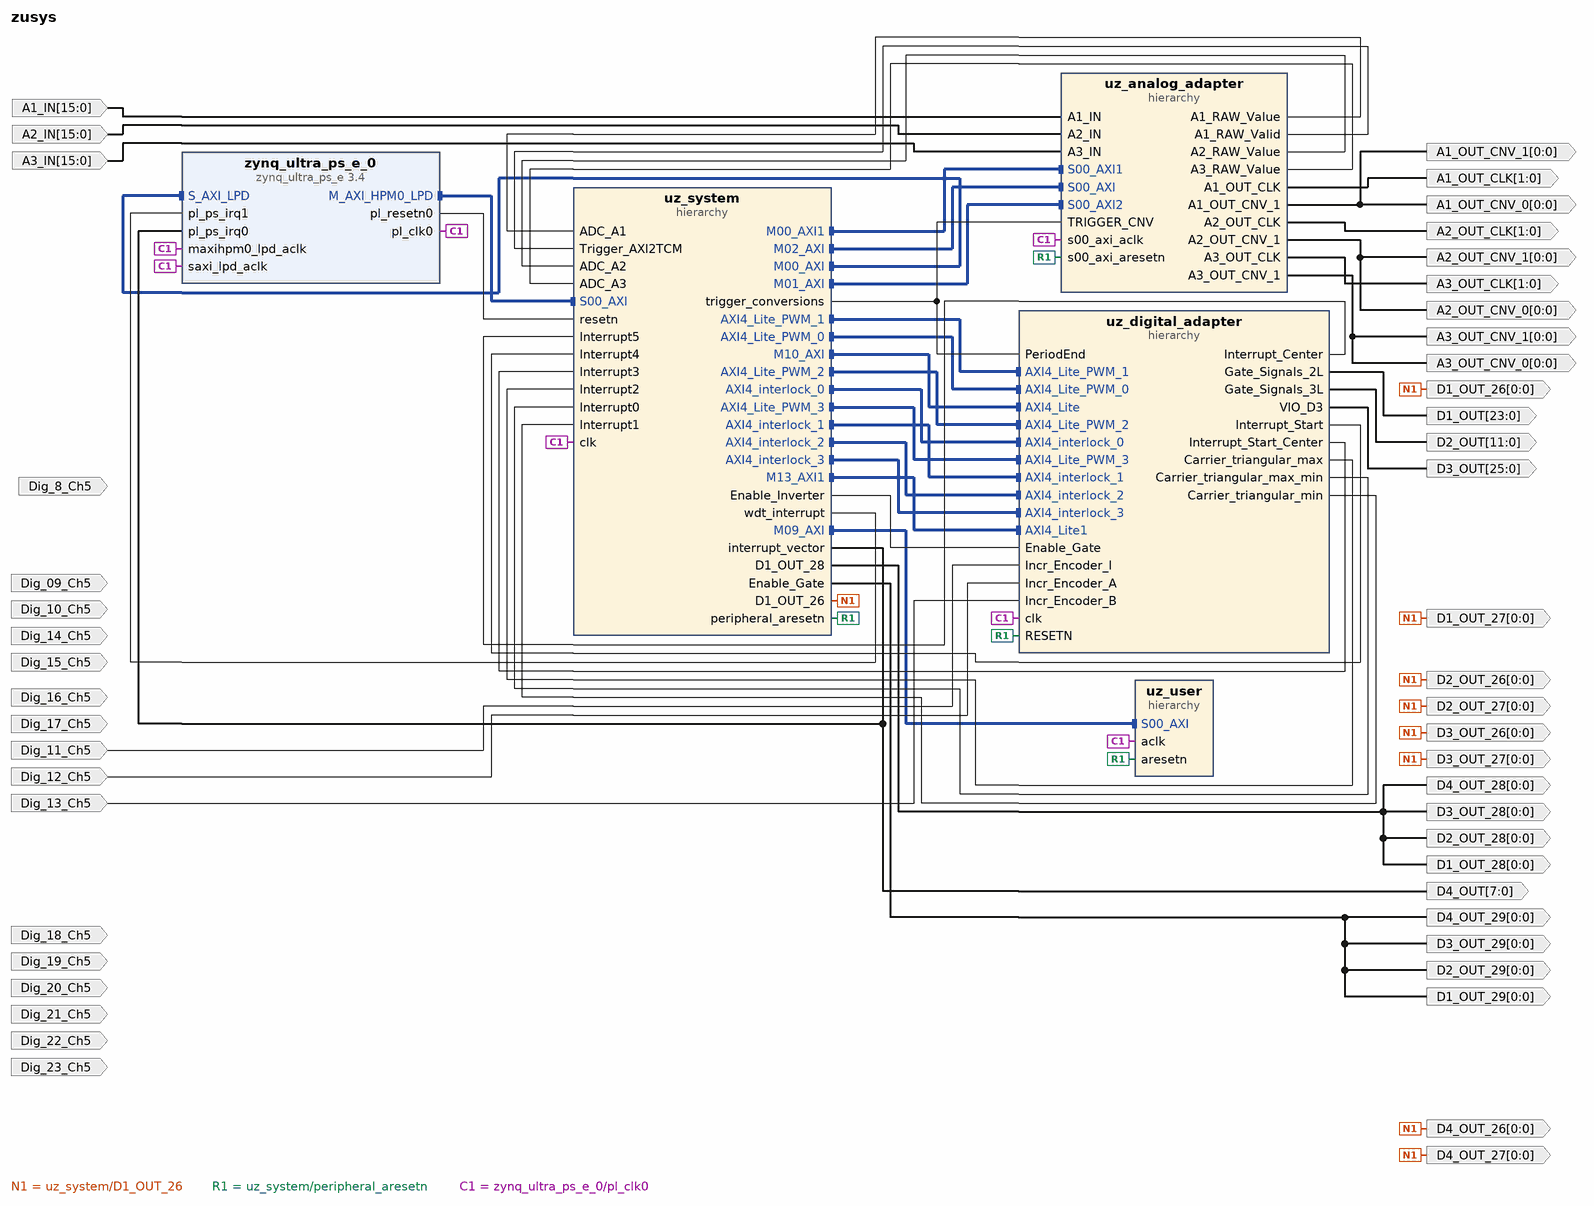
[diagram p0: block diagram of the top level]
# Vivado block design zusys, xczu9eg-ffvc900-1-e, Vivado 2022.2
create_bd_design zusys

create_bd_port -dir I -from 15 -to 0 A1_IN
create_bd_port -dir O -from 1 -to 0 A1_OUT_CLK
create_bd_port -dir O -from 0 -to 0 A1_OUT_CNV_0
create_bd_port -dir O -from 0 -to 0 A1_OUT_CNV_1
create_bd_port -dir I -from 15 -to 0 A2_IN
create_bd_port -dir O -from 1 -to 0 A2_OUT_CLK
create_bd_port -dir O -from 0 -to 0 A2_OUT_CNV_0
create_bd_port -dir O -from 0 -to 0 A2_OUT_CNV_1
create_bd_port -dir I -from 15 -to 0 A3_IN
create_bd_port -dir O -from 1 -to 0 A3_OUT_CLK
create_bd_port -dir O -from 0 -to 0 A3_OUT_CNV_0
create_bd_port -dir O -from 0 -to 0 A3_OUT_CNV_1
create_bd_port -dir O -from 23 -to 0 D1_OUT
create_bd_port -dir O -from 0 -to 0 D1_OUT_26
create_bd_port -dir O -from 0 -to 0 D1_OUT_27
create_bd_port -dir O -from 0 -to 0 D1_OUT_28
create_bd_port -dir O -from 0 -to 0 D1_OUT_29
create_bd_port -dir O -from 11 -to 0 D2_OUT
create_bd_port -dir O -from 0 -to 0 D2_OUT_26
create_bd_port -dir O -from 0 -to 0 D2_OUT_27
create_bd_port -dir O -from 0 -to 0 D2_OUT_28
create_bd_port -dir O -from 0 -to 0 D2_OUT_29
create_bd_port -dir O -from 25 -to 0 D3_OUT
create_bd_port -dir O -from 0 -to 0 D3_OUT_26
create_bd_port -dir O -from 0 -to 0 D3_OUT_27
create_bd_port -dir O -from 0 -to 0 D3_OUT_28
create_bd_port -dir O -from 0 -to 0 D3_OUT_29
create_bd_port -dir O -from 7 -to 0 D4_OUT
create_bd_port -dir O -from 0 -to 0 D4_OUT_26
create_bd_port -dir O -from 0 -to 0 D4_OUT_27
create_bd_port -dir O -from 0 -to 0 D4_OUT_28
create_bd_port -dir O -from 0 -to 0 D4_OUT_29
create_bd_port -dir I Dig_09_Ch5
create_bd_port -dir I Dig_10_Ch5
create_bd_port -dir I Dig_11_Ch5
create_bd_port -dir I Dig_12_Ch5
create_bd_port -dir I Dig_13_Ch5
create_bd_port -dir I Dig_14_Ch5
create_bd_port -dir I Dig_15_Ch5
create_bd_port -dir I Dig_16_Ch5
create_bd_port -dir I Dig_17_Ch5
create_bd_port -dir I Dig_18_Ch5
create_bd_port -dir I Dig_19_Ch5
create_bd_port -dir I Dig_20_Ch5
create_bd_port -dir I Dig_21_Ch5
create_bd_port -dir I Dig_22_Ch5
create_bd_port -dir I Dig_23_Ch5
create_bd_port -dir I Dig_8_Ch5

create_bd_cell -type hier uz_analog_adapter
create_bd_cell -type hier uz_digital_adapter
create_bd_cell -type hier uz_system
create_bd_cell -type hier uz_user
create_bd_cell -type ip -vlnv xilinx.com:ip:zynq_ultra_ps_e:3.4 zynq_ultra_ps_e_0
set_property -dict [list \
  CONFIG.CAN0_BOARD_INTERFACE custom \
  CONFIG.CAN1_BOARD_INTERFACE custom \
  CONFIG.CSU_BOARD_INTERFACE custom \
  CONFIG.DP_BOARD_INTERFACE custom \
  CONFIG.GEM0_BOARD_INTERFACE custom \
  CONFIG.GEM1_BOARD_INTERFACE custom \
  CONFIG.GEM2_BOARD_INTERFACE custom \
  CONFIG.GEM3_BOARD_INTERFACE custom \
  CONFIG.GPIO_BOARD_INTERFACE custom \
  CONFIG.IIC0_BOARD_INTERFACE custom \
  CONFIG.IIC1_BOARD_INTERFACE custom \
  CONFIG.NAND_BOARD_INTERFACE custom \
  CONFIG.PCIE_BOARD_INTERFACE custom \
  CONFIG.PJTAG_BOARD_INTERFACE custom \
  CONFIG.PMU_BOARD_INTERFACE custom \
  CONFIG.PSU_BANK_0_IO_STANDARD LVCMOS18 \
  CONFIG.PSU_BANK_1_IO_STANDARD LVCMOS18 \
  CONFIG.PSU_BANK_2_IO_STANDARD LVCMOS18 \
  CONFIG.PSU_BANK_3_IO_STANDARD LVCMOS18 \
  CONFIG.PSU_USB3__DUAL_CLOCK_ENABLE 0 \
  CONFIG.PSU__CAN0__PERIPHERAL__ENABLE 1 \
  CONFIG.PSU__CAN0__PERIPHERAL__IO {MIO 22 .. 23} \
  CONFIG.PSU__CAN1__PERIPHERAL__ENABLE 1 \
  CONFIG.PSU__CAN1__PERIPHERAL__IO {MIO 24 .. 25} \
  CONFIG.PSU__CRF_APB__ACPU_CTRL__FREQMHZ 1200 \
  CONFIG.PSU__CRF_APB__ACPU_CTRL__SRCSEL APLL \
  CONFIG.PSU__CRF_APB__APLL_CTRL__SRCSEL PSS_REF_CLK \
  CONFIG.PSU__CRF_APB__DBG_FPD_CTRL__FREQMHZ 250 \
  CONFIG.PSU__CRF_APB__DBG_FPD_CTRL__SRCSEL IOPLL \
  CONFIG.PSU__CRF_APB__DBG_TRACE_CTRL__FREQMHZ 250 \
  CONFIG.PSU__CRF_APB__DBG_TRACE_CTRL__SRCSEL IOPLL \
  CONFIG.PSU__CRF_APB__DBG_TSTMP_CTRL__FREQMHZ 250 \
  CONFIG.PSU__CRF_APB__DBG_TSTMP_CTRL__SRCSEL IOPLL \
  CONFIG.PSU__CRF_APB__DDR_CTRL__FREQMHZ 1200 \
  CONFIG.PSU__CRF_APB__DDR_CTRL__SRCSEL DPLL \
  CONFIG.PSU__CRF_APB__DPDMA_REF_CTRL__FREQMHZ 600 \
  CONFIG.PSU__CRF_APB__DPDMA_REF_CTRL__SRCSEL DPLL \
  CONFIG.PSU__CRF_APB__DPLL_CTRL__SRCSEL PSS_REF_CLK \
  CONFIG.PSU__CRF_APB__DP_AUDIO_REF_CTRL__SRCSEL VPLL \
  CONFIG.PSU__CRF_APB__DP_STC_REF_CTRL__SRCSEL VPLL \
  CONFIG.PSU__CRF_APB__DP_VIDEO_REF_CTRL__SRCSEL VPLL \
  CONFIG.PSU__CRF_APB__GDMA_REF_CTRL__FREQMHZ 600 \
  CONFIG.PSU__CRF_APB__GDMA_REF_CTRL__SRCSEL DPLL \
  CONFIG.PSU__CRF_APB__GPU_REF_CTRL__FREQMHZ 600 \
  CONFIG.PSU__CRF_APB__GPU_REF_CTRL__SRCSEL DPLL \
  CONFIG.PSU__CRF_APB__TOPSW_LSBUS_CTRL__FREQMHZ 100 \
  CONFIG.PSU__CRF_APB__TOPSW_LSBUS_CTRL__SRCSEL IOPLL \
  CONFIG.PSU__CRF_APB__TOPSW_MAIN_CTRL__FREQMHZ 533.333 \
  CONFIG.PSU__CRF_APB__TOPSW_MAIN_CTRL__SRCSEL APLL \
  CONFIG.PSU__CRF_APB__VPLL_CTRL__SRCSEL PSS_REF_CLK \
  CONFIG.PSU__CRL_APB__ADMA_REF_CTRL__FREQMHZ 500 \
  CONFIG.PSU__CRL_APB__ADMA_REF_CTRL__SRCSEL IOPLL \
  CONFIG.PSU__CRL_APB__CAN1_REF_CTRL__FREQMHZ 100 \
  CONFIG.PSU__CRL_APB__CAN1_REF_CTRL__SRCSEL IOPLL \
  CONFIG.PSU__CRL_APB__CPU_R5_CTRL__FREQMHZ 500 \
  CONFIG.PSU__CRL_APB__CPU_R5_CTRL__SRCSEL IOPLL \
  CONFIG.PSU__CRL_APB__DBG_LPD_CTRL__FREQMHZ 250 \
  CONFIG.PSU__CRL_APB__DBG_LPD_CTRL__SRCSEL IOPLL \
  CONFIG.PSU__CRL_APB__GEM3_REF_CTRL__FREQMHZ 125 \
  CONFIG.PSU__CRL_APB__GEM3_REF_CTRL__SRCSEL IOPLL \
  CONFIG.PSU__CRL_APB__I2C0_REF_CTRL__FREQMHZ 100 \
  CONFIG.PSU__CRL_APB__I2C0_REF_CTRL__SRCSEL IOPLL \
  CONFIG.PSU__CRL_APB__I2C1_REF_CTRL__FREQMHZ 100 \
  CONFIG.PSU__CRL_APB__I2C1_REF_CTRL__SRCSEL IOPLL \
  CONFIG.PSU__CRL_APB__IOPLL_CTRL__SRCSEL PSS_REF_CLK \
  CONFIG.PSU__CRL_APB__IOU_SWITCH_CTRL__FREQMHZ 267 \
  CONFIG.PSU__CRL_APB__IOU_SWITCH_CTRL__SRCSEL RPLL \
  CONFIG.PSU__CRL_APB__LPD_LSBUS_CTRL__FREQMHZ 100 \
  CONFIG.PSU__CRL_APB__LPD_LSBUS_CTRL__SRCSEL IOPLL \
  CONFIG.PSU__CRL_APB__LPD_SWITCH_CTRL__FREQMHZ 500 \
  CONFIG.PSU__CRL_APB__LPD_SWITCH_CTRL__SRCSEL IOPLL \
  CONFIG.PSU__CRL_APB__PCAP_CTRL__FREQMHZ 200 \
  CONFIG.PSU__CRL_APB__PCAP_CTRL__SRCSEL IOPLL \
  CONFIG.PSU__CRL_APB__PL0_REF_CTRL__FREQMHZ 100 \
  CONFIG.PSU__CRL_APB__PL0_REF_CTRL__SRCSEL RPLL \
  CONFIG.PSU__CRL_APB__QSPI_REF_CTRL__FREQMHZ 300 \
  CONFIG.PSU__CRL_APB__QSPI_REF_CTRL__SRCSEL IOPLL \
  CONFIG.PSU__CRL_APB__RPLL_CTRL__SRCSEL PSS_REF_CLK \
  CONFIG.PSU__CRL_APB__SDIO1_REF_CTRL__FREQMHZ 200 \
  CONFIG.PSU__CRL_APB__SDIO1_REF_CTRL__SRCSEL RPLL \
  CONFIG.PSU__CRL_APB__TIMESTAMP_REF_CTRL__FREQMHZ 100 \
  CONFIG.PSU__CRL_APB__TIMESTAMP_REF_CTRL__SRCSEL PSS_REF_CLK \
  CONFIG.PSU__CRL_APB__UART0_REF_CTRL__FREQMHZ 100 \
  CONFIG.PSU__CRL_APB__UART0_REF_CTRL__SRCSEL IOPLL \
  CONFIG.PSU__CRL_APB__UART1_REF_CTRL__FREQMHZ 100 \
  CONFIG.PSU__CRL_APB__UART1_REF_CTRL__SRCSEL IOPLL \
  CONFIG.PSU__CRL_APB__USB0_BUS_REF_CTRL__FREQMHZ 250 \
  CONFIG.PSU__CRL_APB__USB0_BUS_REF_CTRL__SRCSEL IOPLL \
  CONFIG.PSU__CRL_APB__USB3_DUAL_REF_CTRL__FREQMHZ 20 \
  CONFIG.PSU__CRL_APB__USB3_DUAL_REF_CTRL__SRCSEL IOPLL \
  CONFIG.PSU__CRL_APB__USB3__ENABLE 0 \
  CONFIG.PSU__CSUPMU__PERIPHERAL__VALID 0 \
  CONFIG.PSU__DDRC__BUS_WIDTH {64 Bit} \
  CONFIG.PSU__DDRC__COMPONENTS Components \
  CONFIG.PSU__DDRC__DEVICE_CAPACITY {8192 MBits} \
  CONFIG.PSU__DDRC__DRAM_WIDTH {16 Bits} \
  CONFIG.PSU__DDRC__ECC Disabled \
  CONFIG.PSU__DDRC__MEMORY_TYPE {DDR 4} \
  CONFIG.PSU__DDRC__SPEED_BIN DDR4_2400P \
  CONFIG.PSU__DDR_HIGH_ADDRESS_GUI_ENABLE 1 \
  CONFIG.PSU__DDR__INTERFACE__FREQMHZ 600.000 \
  CONFIG.PSU__DEVICE_TYPE EG \
  CONFIG.PSU__DISPLAYPORT__PERIPHERAL__ENABLE 0 \
  CONFIG.PSU__DLL__ISUSED 1 \
  CONFIG.PSU__ENET3__FIFO__ENABLE 0 \
  CONFIG.PSU__ENET3__GRP_MDIO__ENABLE 1 \
  CONFIG.PSU__ENET3__GRP_MDIO__IO {MIO 76 .. 77} \
  CONFIG.PSU__ENET3__PERIPHERAL__ENABLE 1 \
  CONFIG.PSU__ENET3__PERIPHERAL__IO {MIO 64 .. 75} \
  CONFIG.PSU__ENET3__PTP__ENABLE 0 \
  CONFIG.PSU__ENET3__TSU__ENABLE 0 \
  CONFIG.PSU__FPD_SLCR__WDT1__FREQMHZ 99.999985 \
  CONFIG.PSU__FPGA_PL0_ENABLE 1 \
  CONFIG.PSU__GEM3_COHERENCY 0 \
  CONFIG.PSU__GEM3_ROUTE_THROUGH_FPD 0 \
  CONFIG.PSU__GEM__TSU__ENABLE 0 \
  CONFIG.PSU__GPIO0_MIO__IO {MIO 0 .. 25} \
  CONFIG.PSU__GPIO0_MIO__PERIPHERAL__ENABLE 1 \
  CONFIG.PSU__GPIO1_MIO__IO {MIO 26 .. 51} \
  CONFIG.PSU__GPIO1_MIO__PERIPHERAL__ENABLE 1 \
  CONFIG.PSU__GPIO2_MIO__IO {MIO 52 .. 77} \
  CONFIG.PSU__GPIO2_MIO__PERIPHERAL__ENABLE 1 \
  CONFIG.PSU__I2C0__PERIPHERAL__ENABLE 1 \
  CONFIG.PSU__I2C0__PERIPHERAL__IO {MIO 14 .. 15} \
  CONFIG.PSU__I2C1__PERIPHERAL__ENABLE 1 \
  CONFIG.PSU__I2C1__PERIPHERAL__IO {MIO 16 .. 17} \
  CONFIG.PSU__IOU_SLCR__IOU_TTC_APB_CLK__TTC0_SEL APB \
  CONFIG.PSU__IOU_SLCR__IOU_TTC_APB_CLK__TTC1_SEL APB \
  CONFIG.PSU__IOU_SLCR__IOU_TTC_APB_CLK__TTC2_SEL APB \
  CONFIG.PSU__IOU_SLCR__IOU_TTC_APB_CLK__TTC3_SEL APB \
  CONFIG.PSU__IOU_SLCR__WDT0__FREQMHZ 99.999985 \
  CONFIG.PSU__LPD_SLCR__CSUPMU__FREQMHZ 100 \
  CONFIG.PSU__MAXIGP2__DATA_WIDTH 128 \
  CONFIG.PSU__M_AXI_GP2__FREQMHZ 100.0 \
  CONFIG.PSU__OVERRIDE_HPX_QOS 0 \
  CONFIG.PSU__OVERRIDE__BASIC_CLOCK 0 \
  CONFIG.PSU__PCIE__CLASS_CODE_BASE 0x06 \
  CONFIG.PSU__PCIE__CLASS_CODE_INTERFACE 0x0 \
  CONFIG.PSU__PCIE__CLASS_CODE_SUB 0x04 \
  CONFIG.PSU__PCIE__DEVICE_ID 0xD021 \
  CONFIG.PSU__PCIE__REVISION_ID 0x0 \
  CONFIG.PSU__PCIE__SUBSYSTEM_ID 0x7 \
  CONFIG.PSU__PCIE__SUBSYSTEM_VENDOR_ID 0x10EE \
  CONFIG.PSU__PCIE__VENDOR_ID 0x10EE \
  CONFIG.PSU__PMU__PERIPHERAL__ENABLE 0 \
  CONFIG.PSU__PRESET_APPLIED 0 \
  CONFIG.PSU__PSS_REF_CLK__FREQMHZ 33.333333 \
  CONFIG.PSU__QSPI_COHERENCY 0 \
  CONFIG.PSU__QSPI_ROUTE_THROUGH_FPD 0 \
  CONFIG.PSU__QSPI__GRP_FBCLK__ENABLE 1 \
  CONFIG.PSU__QSPI__GRP_FBCLK__IO {MIO 6} \
  CONFIG.PSU__QSPI__PERIPHERAL__DATA_MODE x4 \
  CONFIG.PSU__QSPI__PERIPHERAL__ENABLE 1 \
  CONFIG.PSU__QSPI__PERIPHERAL__IO {MIO 0 .. 12} \
  CONFIG.PSU__QSPI__PERIPHERAL__MODE {Dual Parallel} \
  CONFIG.PSU__SATA__PERIPHERAL__ENABLE 0 \
  CONFIG.PSU__SAXIGP6__DATA_WIDTH 32 \
  CONFIG.PSU__SD0__CLK_100_SDR_OTAP_DLY 0x3 \
  CONFIG.PSU__SD0__CLK_200_SDR_OTAP_DLY 0x3 \
  CONFIG.PSU__SD0__CLK_50_DDR_ITAP_DLY 0x3D \
  CONFIG.PSU__SD0__CLK_50_DDR_OTAP_DLY 0x4 \
  CONFIG.PSU__SD0__CLK_50_SDR_ITAP_DLY 0x15 \
  CONFIG.PSU__SD0__CLK_50_SDR_OTAP_DLY 0x5 \
  CONFIG.PSU__SD0__RESET__ENABLE 1 \
  CONFIG.PSU__SD1_COHERENCY 0 \
  CONFIG.PSU__SD1_ROUTE_THROUGH_FPD 0 \
  CONFIG.PSU__SD1__CLK_50_SDR_ITAP_DLY 0x15 \
  CONFIG.PSU__SD1__CLK_50_SDR_OTAP_DLY 0x5 \
  CONFIG.PSU__SD1__DATA_TRANSFER_MODE 4Bit \
  CONFIG.PSU__SD1__GRP_CD__ENABLE 0 \
  CONFIG.PSU__SD1__GRP_POW__ENABLE 0 \
  CONFIG.PSU__SD1__GRP_WP__ENABLE 0 \
  CONFIG.PSU__SD1__PERIPHERAL__ENABLE 1 \
  CONFIG.PSU__SD1__PERIPHERAL__IO {MIO 46 .. 51} \
  CONFIG.PSU__SD1__SLOT_TYPE {SD 2.0} \
  CONFIG.PSU__SPI0__GRP_SS0__IO {MIO 41} \
  CONFIG.PSU__SPI0__PERIPHERAL__ENABLE 1 \
  CONFIG.PSU__SPI0__PERIPHERAL__IO {MIO 38 .. 43} \
  CONFIG.PSU__SPI1__GRP_SS0__IO {MIO 35} \
  CONFIG.PSU__SPI1__PERIPHERAL__ENABLE 1 \
  CONFIG.PSU__SPI1__PERIPHERAL__IO {MIO 32 .. 37} \
  CONFIG.PSU__SWDT0__PERIPHERAL__ENABLE 0 \
  CONFIG.PSU__SWDT1__PERIPHERAL__ENABLE 0 \
  CONFIG.PSU__TSU__BUFG_PORT_PAIR 0 \
  CONFIG.PSU__TTC0__CLOCK__ENABLE 0 \
  CONFIG.PSU__TTC0__PERIPHERAL__ENABLE 1 \
  CONFIG.PSU__TTC0__WAVEOUT__ENABLE 0 \
  CONFIG.PSU__TTC1__PERIPHERAL__ENABLE 0 \
  CONFIG.PSU__TTC2__PERIPHERAL__ENABLE 0 \
  CONFIG.PSU__TTC3__CLOCK__ENABLE 0 \
  CONFIG.PSU__TTC3__PERIPHERAL__ENABLE 1 \
  CONFIG.PSU__TTC3__WAVEOUT__ENABLE 0 \
  CONFIG.PSU__UART0__BAUD_RATE 115200 \
  CONFIG.PSU__UART0__MODEM__ENABLE 0 \
  CONFIG.PSU__UART0__PERIPHERAL__ENABLE 1 \
  CONFIG.PSU__UART0__PERIPHERAL__IO {MIO 18 .. 19} \
  CONFIG.PSU__UART1__BAUD_RATE 115200 \
  CONFIG.PSU__UART1__MODEM__ENABLE 0 \
  CONFIG.PSU__UART1__PERIPHERAL__ENABLE 1 \
  CONFIG.PSU__UART1__PERIPHERAL__IO {MIO 20 .. 21} \
  CONFIG.PSU__USB0__PERIPHERAL__ENABLE 0 \
  CONFIG.PSU__USE__IRQ0 1 \
  CONFIG.PSU__USE__IRQ1 1 \
  CONFIG.PSU__USE__M_AXI_GP0 0 \
  CONFIG.PSU__USE__M_AXI_GP1 0 \
  CONFIG.PSU__USE__M_AXI_GP2 1 \
  CONFIG.PSU__USE__S_AXI_GP6 1 \
  CONFIG.QSPI_BOARD_INTERFACE custom \
  CONFIG.SATA_BOARD_INTERFACE custom \
  CONFIG.SD0_BOARD_INTERFACE custom \
  CONFIG.SD1_BOARD_INTERFACE custom \
  CONFIG.SPI0_BOARD_INTERFACE custom \
  CONFIG.SPI1_BOARD_INTERFACE custom \
  CONFIG.SUBPRESET1 Custom \
  CONFIG.SUBPRESET2 Custom \
  CONFIG.SWDT0_BOARD_INTERFACE custom \
  CONFIG.SWDT1_BOARD_INTERFACE custom \
  CONFIG.TRACE_BOARD_INTERFACE custom \
  CONFIG.TTC0_BOARD_INTERFACE custom \
  CONFIG.TTC1_BOARD_INTERFACE custom \
  CONFIG.TTC2_BOARD_INTERFACE custom \
  CONFIG.TTC3_BOARD_INTERFACE custom \
  CONFIG.UART0_BOARD_INTERFACE custom \
  CONFIG.UART1_BOARD_INTERFACE custom \
  CONFIG.USB0_BOARD_INTERFACE custom \
  CONFIG.USB1_BOARD_INTERFACE custom \
] [get_bd_cells zynq_ultra_ps_e_0]
# 753 more settings of zynq_ultra_ps_e_0 are not shown: defaults, MIO pin electricals, DDR timing, and values the tool derives

# ---- hierarchy /uz_analog_adapter ----
current_bd_instance /uz_analog_adapter
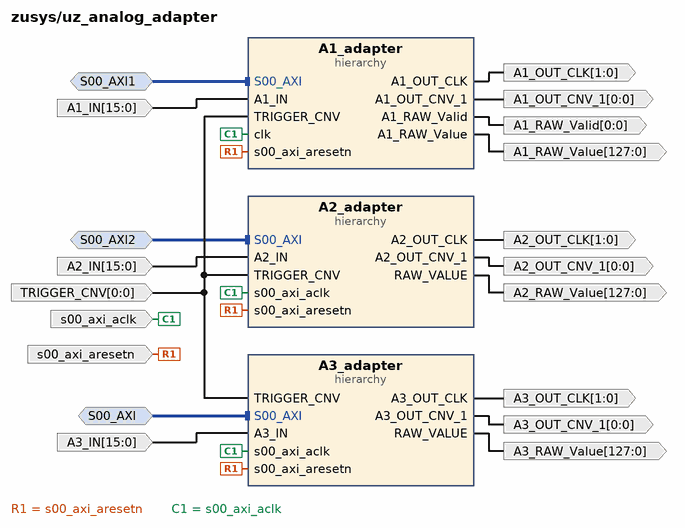
[diagram p1: block diagram inside /uz_analog_adapter]
create_bd_intf_pin -mode Slave -vlnv xilinx.com:interface:aximm_rtl:1.0 S00_AXI
create_bd_intf_pin -mode Slave -vlnv xilinx.com:interface:aximm_rtl:1.0 S00_AXI1
create_bd_intf_pin -mode Slave -vlnv xilinx.com:interface:aximm_rtl:1.0 S00_AXI2
create_bd_pin -dir I -from 15 -to 0 A1_IN
create_bd_pin -dir O -from 1 -to 0 A1_OUT_CLK
create_bd_pin -dir O -from 0 -to 0 A1_OUT_CNV_1
create_bd_pin -dir O -from 0 -to 0 A1_RAW_Valid
create_bd_pin -dir O -from 127 -to 0 A1_RAW_Value
create_bd_pin -dir I -from 15 -to 0 A2_IN
create_bd_pin -dir O -from 1 -to 0 A2_OUT_CLK
create_bd_pin -dir O -from 0 -to 0 A2_OUT_CNV_1
create_bd_pin -dir O -from 127 -to 0 A2_RAW_Value
create_bd_pin -dir I -from 15 -to 0 A3_IN
create_bd_pin -dir O -from 1 -to 0 A3_OUT_CLK
create_bd_pin -dir O -from 0 -to 0 A3_OUT_CNV_1
create_bd_pin -dir O -from 127 -to 0 A3_RAW_Value
create_bd_pin -dir I -from 0 -to 0 TRIGGER_CNV
create_bd_pin -dir I -type clk s00_axi_aclk
create_bd_pin -dir I -type rst s00_axi_aresetn

create_bd_cell -type hier A1_adapter
create_bd_cell -type hier A2_adapter
create_bd_cell -type hier A3_adapter

# ---- hierarchy /uz_analog_adapter/A1_adapter ----
current_bd_instance /uz_analog_adapter/A1_adapter
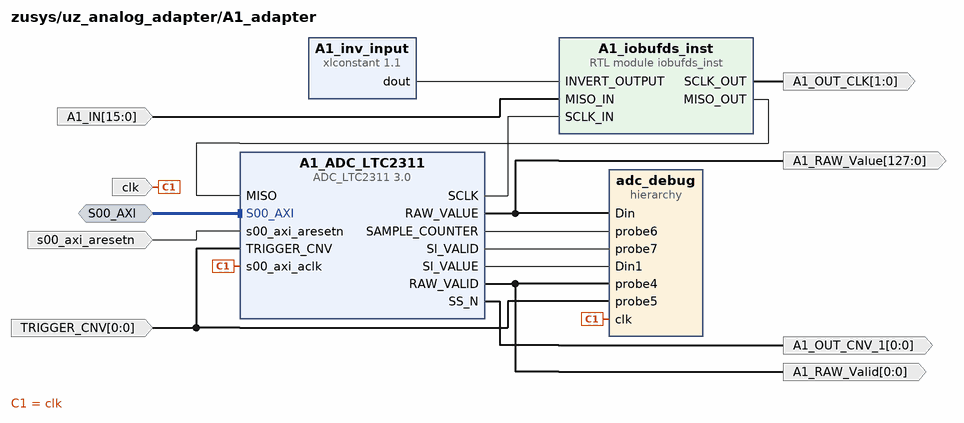
[diagram p2: block diagram inside /uz_analog_adapter/A1_adapter]
create_bd_intf_pin -mode Slave -vlnv xilinx.com:interface:aximm_rtl:1.0 S00_AXI
create_bd_pin -dir I -from 15 -to 0 A1_IN
create_bd_pin -dir O -from 1 -to 0 A1_OUT_CLK
create_bd_pin -dir O -from 0 -to 0 A1_OUT_CNV_1
create_bd_pin -dir O -from 0 -to 0 A1_RAW_Valid
create_bd_pin -dir O -from 127 -to 0 A1_RAW_Value
create_bd_pin -dir I -type clk clk
create_bd_pin -dir I -from 0 -to 0 TRIGGER_CNV
create_bd_pin -dir I -type rst s00_axi_aresetn

create_bd_cell -type ip -vlnv UltraZohm:user:ADC_LTC2311:3.0 A1_ADC_LTC2311
set_property -dict [list \
  CONFIG.DIFFERENTIAL false \
  CONFIG.RES_LSB 0 \
  CONFIG.RES_MSB 34 \
  CONFIG.SPI_MASTER 1 \
] [get_bd_cells A1_ADC_LTC2311]
create_bd_cell -type ip -vlnv xilinx.com:ip:xlconstant:1.1 A1_inv_input
set_property -dict {CONFIG.CONST_VAL 0x00 CONFIG.CONST_WIDTH 8} [get_bd_cells A1_inv_input]
create_bd_cell -type module -reference iobufds_inst A1_iobufds_inst
create_bd_cell -type hier adc_debug

# ---- hierarchy /uz_analog_adapter/A1_adapter/adc_debug ----
current_bd_instance /uz_analog_adapter/A1_adapter/adc_debug
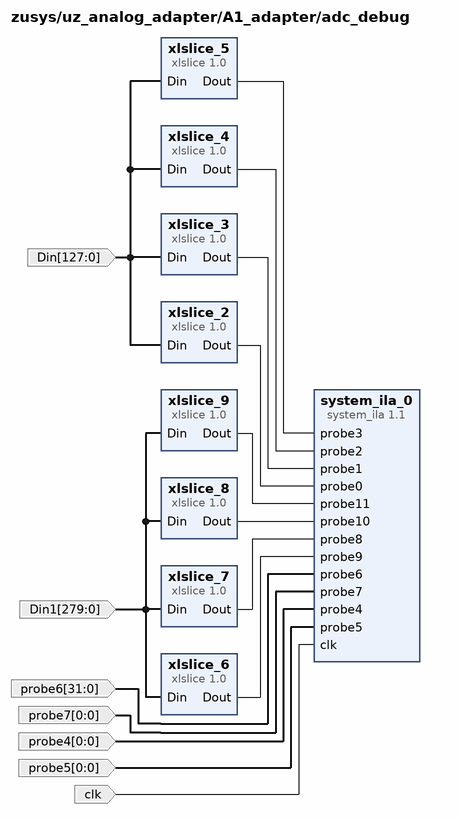
[diagram p3: block diagram inside /uz_analog_adapter/A1_adapter/adc_debug]
create_bd_pin -dir I -from 127 -to 0 Din
create_bd_pin -dir I -from 279 -to 0 Din1
create_bd_pin -dir I -type clk clk
create_bd_pin -dir I -from 0 -to 0 probe4
create_bd_pin -dir I -from 0 -to 0 probe5
create_bd_pin -dir I -from 31 -to 0 probe6
create_bd_pin -dir I -from 0 -to 0 probe7

create_bd_cell -type ip -vlnv xilinx.com:ip:system_ila:1.1 system_ila_0
set_property -dict {CONFIG.C_DATA_DEPTH 1024 CONFIG.C_MON_TYPE NATIVE CONFIG.C_NUM_OF_PROBES 12} [get_bd_cells system_ila_0]
create_bd_cell -type ip -vlnv xilinx.com:ip:xlslice:1.0 xlslice_2
set_property -dict {CONFIG.DIN_FROM 15 CONFIG.DIN_WIDTH 128 CONFIG.DOUT_WIDTH 16} [get_bd_cells xlslice_2]
create_bd_cell -type ip -vlnv xilinx.com:ip:xlslice:1.0 xlslice_3
set_property -dict {CONFIG.DIN_FROM 31 CONFIG.DIN_TO 16 CONFIG.DIN_WIDTH 128 CONFIG.DOUT_WIDTH 16} [get_bd_cells xlslice_3]
create_bd_cell -type ip -vlnv xilinx.com:ip:xlslice:1.0 xlslice_4
set_property -dict {CONFIG.DIN_FROM 47 CONFIG.DIN_TO 32 CONFIG.DIN_WIDTH 128 CONFIG.DOUT_WIDTH 16} [get_bd_cells xlslice_4]
create_bd_cell -type ip -vlnv xilinx.com:ip:xlslice:1.0 xlslice_5
set_property -dict {CONFIG.DIN_FROM 63 CONFIG.DIN_TO 48 CONFIG.DIN_WIDTH 128 CONFIG.DOUT_WIDTH 16} [get_bd_cells xlslice_5]
create_bd_cell -type ip -vlnv xilinx.com:ip:xlslice:1.0 xlslice_6
set_property -dict {CONFIG.DIN_FROM 69 CONFIG.DIN_TO 35 CONFIG.DIN_WIDTH 280 CONFIG.DOUT_WIDTH 35} [get_bd_cells xlslice_6]
create_bd_cell -type ip -vlnv xilinx.com:ip:xlslice:1.0 xlslice_7
set_property -dict {CONFIG.DIN_FROM 34 CONFIG.DIN_WIDTH 280 CONFIG.DOUT_WIDTH 35} [get_bd_cells xlslice_7]
create_bd_cell -type ip -vlnv xilinx.com:ip:xlslice:1.0 xlslice_8
set_property -dict {CONFIG.DIN_FROM 69 CONFIG.DIN_TO 35 CONFIG.DIN_WIDTH 280 CONFIG.DOUT_WIDTH 35} [get_bd_cells xlslice_8]
create_bd_cell -type ip -vlnv xilinx.com:ip:xlslice:1.0 xlslice_9
set_property -dict {CONFIG.DIN_FROM 104 CONFIG.DIN_TO 70 CONFIG.DIN_WIDTH 280 CONFIG.DOUT_WIDTH 35} [get_bd_cells xlslice_9]

# ---- hierarchy /uz_analog_adapter/A2_adapter ----
current_bd_instance /uz_analog_adapter/A2_adapter
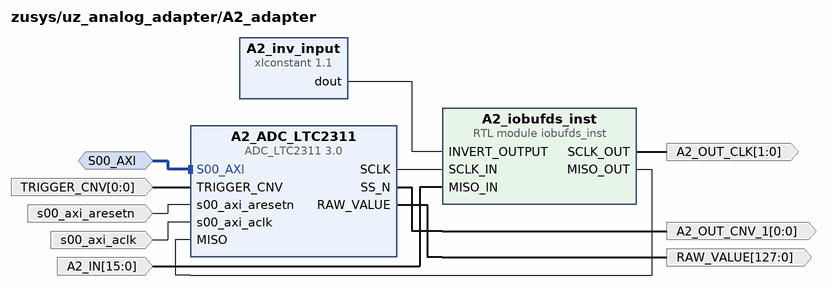
[diagram p4: block diagram inside /uz_analog_adapter/A2_adapter]
create_bd_intf_pin -mode Slave -vlnv xilinx.com:interface:aximm_rtl:1.0 S00_AXI
create_bd_pin -dir I -from 15 -to 0 A2_IN
create_bd_pin -dir O -from 1 -to 0 A2_OUT_CLK
create_bd_pin -dir O -from 0 -to 0 A2_OUT_CNV_1
create_bd_pin -dir O -from 127 -to 0 RAW_VALUE
create_bd_pin -dir I -from 0 -to 0 TRIGGER_CNV
create_bd_pin -dir I -type clk s00_axi_aclk
create_bd_pin -dir I -type rst s00_axi_aresetn

create_bd_cell -type ip -vlnv UltraZohm:user:ADC_LTC2311:3.0 A2_ADC_LTC2311
set_property -dict {CONFIG.DIFFERENTIAL false CONFIG.RES_LSB 0 CONFIG.RES_MSB 34} [get_bd_cells A2_ADC_LTC2311]
create_bd_cell -type ip -vlnv xilinx.com:ip:xlconstant:1.1 A2_inv_input
set_property -dict {CONFIG.CONST_VAL 0x00 CONFIG.CONST_WIDTH 8} [get_bd_cells A2_inv_input]
create_bd_cell -type module -reference iobufds_inst A2_iobufds_inst

# ---- hierarchy /uz_analog_adapter/A3_adapter ----
current_bd_instance /uz_analog_adapter/A3_adapter
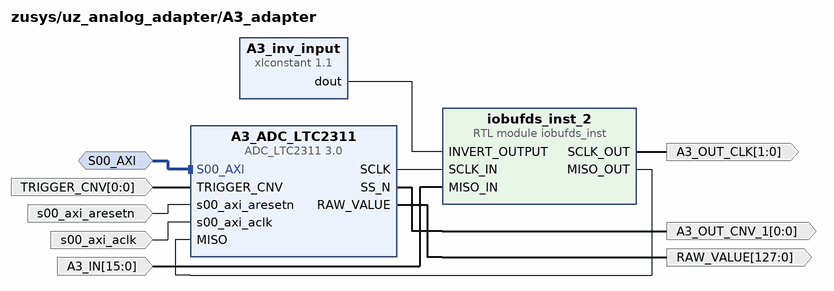
[diagram p5: block diagram inside /uz_analog_adapter/A3_adapter]
create_bd_intf_pin -mode Slave -vlnv xilinx.com:interface:aximm_rtl:1.0 S00_AXI
create_bd_pin -dir I -from 15 -to 0 A3_IN
create_bd_pin -dir O -from 1 -to 0 A3_OUT_CLK
create_bd_pin -dir O -from 0 -to 0 A3_OUT_CNV_1
create_bd_pin -dir O -from 127 -to 0 RAW_VALUE
create_bd_pin -dir I -from 0 -to 0 TRIGGER_CNV
create_bd_pin -dir I -type clk s00_axi_aclk
create_bd_pin -dir I -type rst s00_axi_aresetn

create_bd_cell -type ip -vlnv UltraZohm:user:ADC_LTC2311:3.0 A3_ADC_LTC2311
set_property -dict {CONFIG.DIFFERENTIAL false CONFIG.RES_LSB 0 CONFIG.RES_MSB 34} [get_bd_cells A3_ADC_LTC2311]
create_bd_cell -type ip -vlnv xilinx.com:ip:xlconstant:1.1 A3_inv_input
set_property -dict {CONFIG.CONST_VAL 0x00 CONFIG.CONST_WIDTH 8} [get_bd_cells A3_inv_input]
create_bd_cell -type module -reference iobufds_inst iobufds_inst_2

# ---- hierarchy /uz_digital_adapter ----
current_bd_instance /uz_digital_adapter
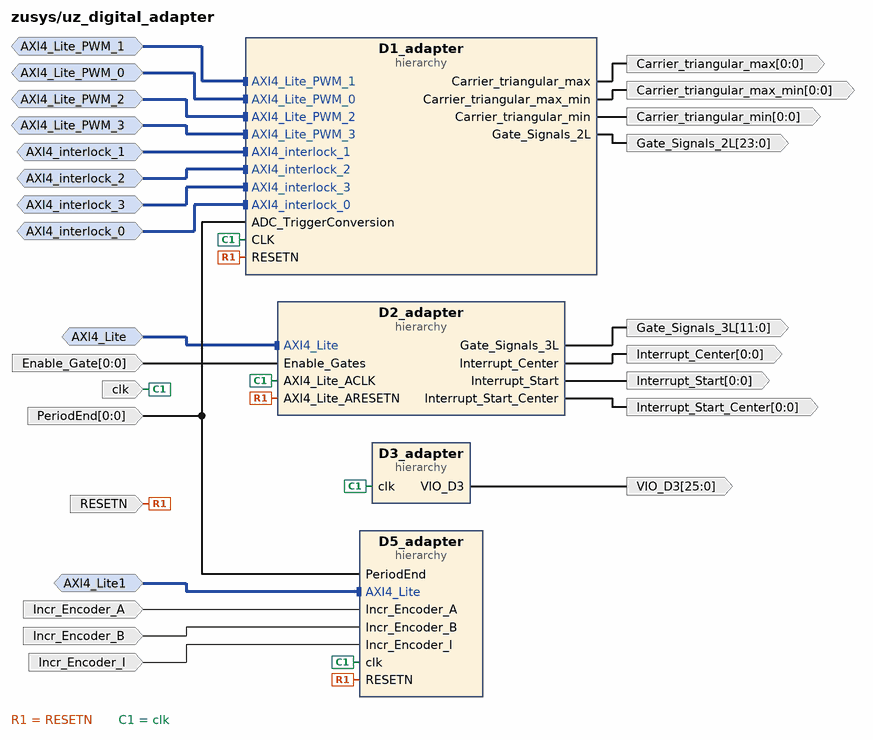
[diagram p6: block diagram inside /uz_digital_adapter]
create_bd_intf_pin -mode Slave -vlnv xilinx.com:interface:aximm_rtl:1.0 AXI4_Lite
create_bd_intf_pin -mode Slave -vlnv xilinx.com:interface:aximm_rtl:1.0 AXI4_Lite1
create_bd_intf_pin -mode Slave -vlnv xilinx.com:interface:aximm_rtl:1.0 AXI4_Lite_PWM_0
create_bd_intf_pin -mode Slave -vlnv xilinx.com:interface:aximm_rtl:1.0 AXI4_Lite_PWM_1
create_bd_intf_pin -mode Slave -vlnv xilinx.com:interface:aximm_rtl:1.0 AXI4_Lite_PWM_2
create_bd_intf_pin -mode Slave -vlnv xilinx.com:interface:aximm_rtl:1.0 AXI4_Lite_PWM_3
create_bd_intf_pin -mode Slave -vlnv xilinx.com:interface:aximm_rtl:1.0 AXI4_interlock_0
create_bd_intf_pin -mode Slave -vlnv xilinx.com:interface:aximm_rtl:1.0 AXI4_interlock_1
create_bd_intf_pin -mode Slave -vlnv xilinx.com:interface:aximm_rtl:1.0 AXI4_interlock_2
create_bd_intf_pin -mode Slave -vlnv xilinx.com:interface:aximm_rtl:1.0 AXI4_interlock_3
create_bd_pin -dir O -from 0 -to 0 Carrier_triangular_max
create_bd_pin -dir O -from 0 -to 0 Carrier_triangular_max_min
create_bd_pin -dir O -from 0 -to 0 Carrier_triangular_min
create_bd_pin -dir I -from 0 -to 0 Enable_Gate
create_bd_pin -dir O -from 23 -to 0 Gate_Signals_2L
create_bd_pin -dir O -from 11 -to 0 Gate_Signals_3L
create_bd_pin -dir I Incr_Encoder_A
create_bd_pin -dir I Incr_Encoder_B
create_bd_pin -dir I Incr_Encoder_I
create_bd_pin -dir O -from 0 -to 0 Interrupt_Center
create_bd_pin -dir O -from 0 -to 0 Interrupt_Start
create_bd_pin -dir O -from 0 -to 0 Interrupt_Start_Center
create_bd_pin -dir I -from 0 -to 0 PeriodEnd
create_bd_pin -dir I -type rst RESETN
create_bd_pin -dir O -from 25 -to 0 VIO_D3
create_bd_pin -dir I -type clk clk

create_bd_cell -type hier D1_adapter
create_bd_cell -type hier D2_adapter
create_bd_cell -type hier D3_adapter
create_bd_cell -type hier D5_adapter

# ---- hierarchy /uz_digital_adapter/D1_adapter ----
current_bd_instance /uz_digital_adapter/D1_adapter
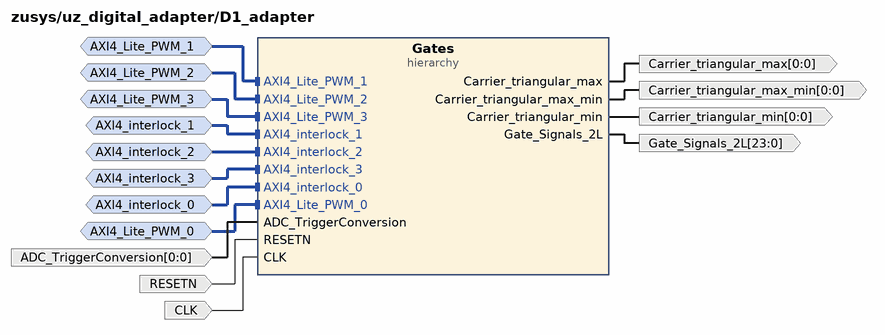
[diagram p7: block diagram inside /uz_digital_adapter/D1_adapter]
create_bd_intf_pin -mode Slave -vlnv xilinx.com:interface:aximm_rtl:1.0 AXI4_Lite_PWM_0
create_bd_intf_pin -mode Slave -vlnv xilinx.com:interface:aximm_rtl:1.0 AXI4_Lite_PWM_1
create_bd_intf_pin -mode Slave -vlnv xilinx.com:interface:aximm_rtl:1.0 AXI4_Lite_PWM_2
create_bd_intf_pin -mode Slave -vlnv xilinx.com:interface:aximm_rtl:1.0 AXI4_Lite_PWM_3
create_bd_intf_pin -mode Slave -vlnv xilinx.com:interface:aximm_rtl:1.0 AXI4_interlock_0
create_bd_intf_pin -mode Slave -vlnv xilinx.com:interface:aximm_rtl:1.0 AXI4_interlock_1
create_bd_intf_pin -mode Slave -vlnv xilinx.com:interface:aximm_rtl:1.0 AXI4_interlock_2
create_bd_intf_pin -mode Slave -vlnv xilinx.com:interface:aximm_rtl:1.0 AXI4_interlock_3
create_bd_pin -dir I -type clk CLK
create_bd_pin -dir O -from 0 -to 0 Carrier_triangular_max
create_bd_pin -dir O -from 0 -to 0 Carrier_triangular_max_min
create_bd_pin -dir O -from 0 -to 0 Carrier_triangular_min
create_bd_pin -dir O -from 23 -to 0 Gate_Signals_2L
create_bd_pin -dir I -type rst RESETN
create_bd_pin -dir I -from 0 -to 0 ADC_TriggerConversion

create_bd_cell -type hier Gates

# ---- hierarchy /uz_digital_adapter/D1_adapter/Gates ----
current_bd_instance /uz_digital_adapter/D1_adapter/Gates
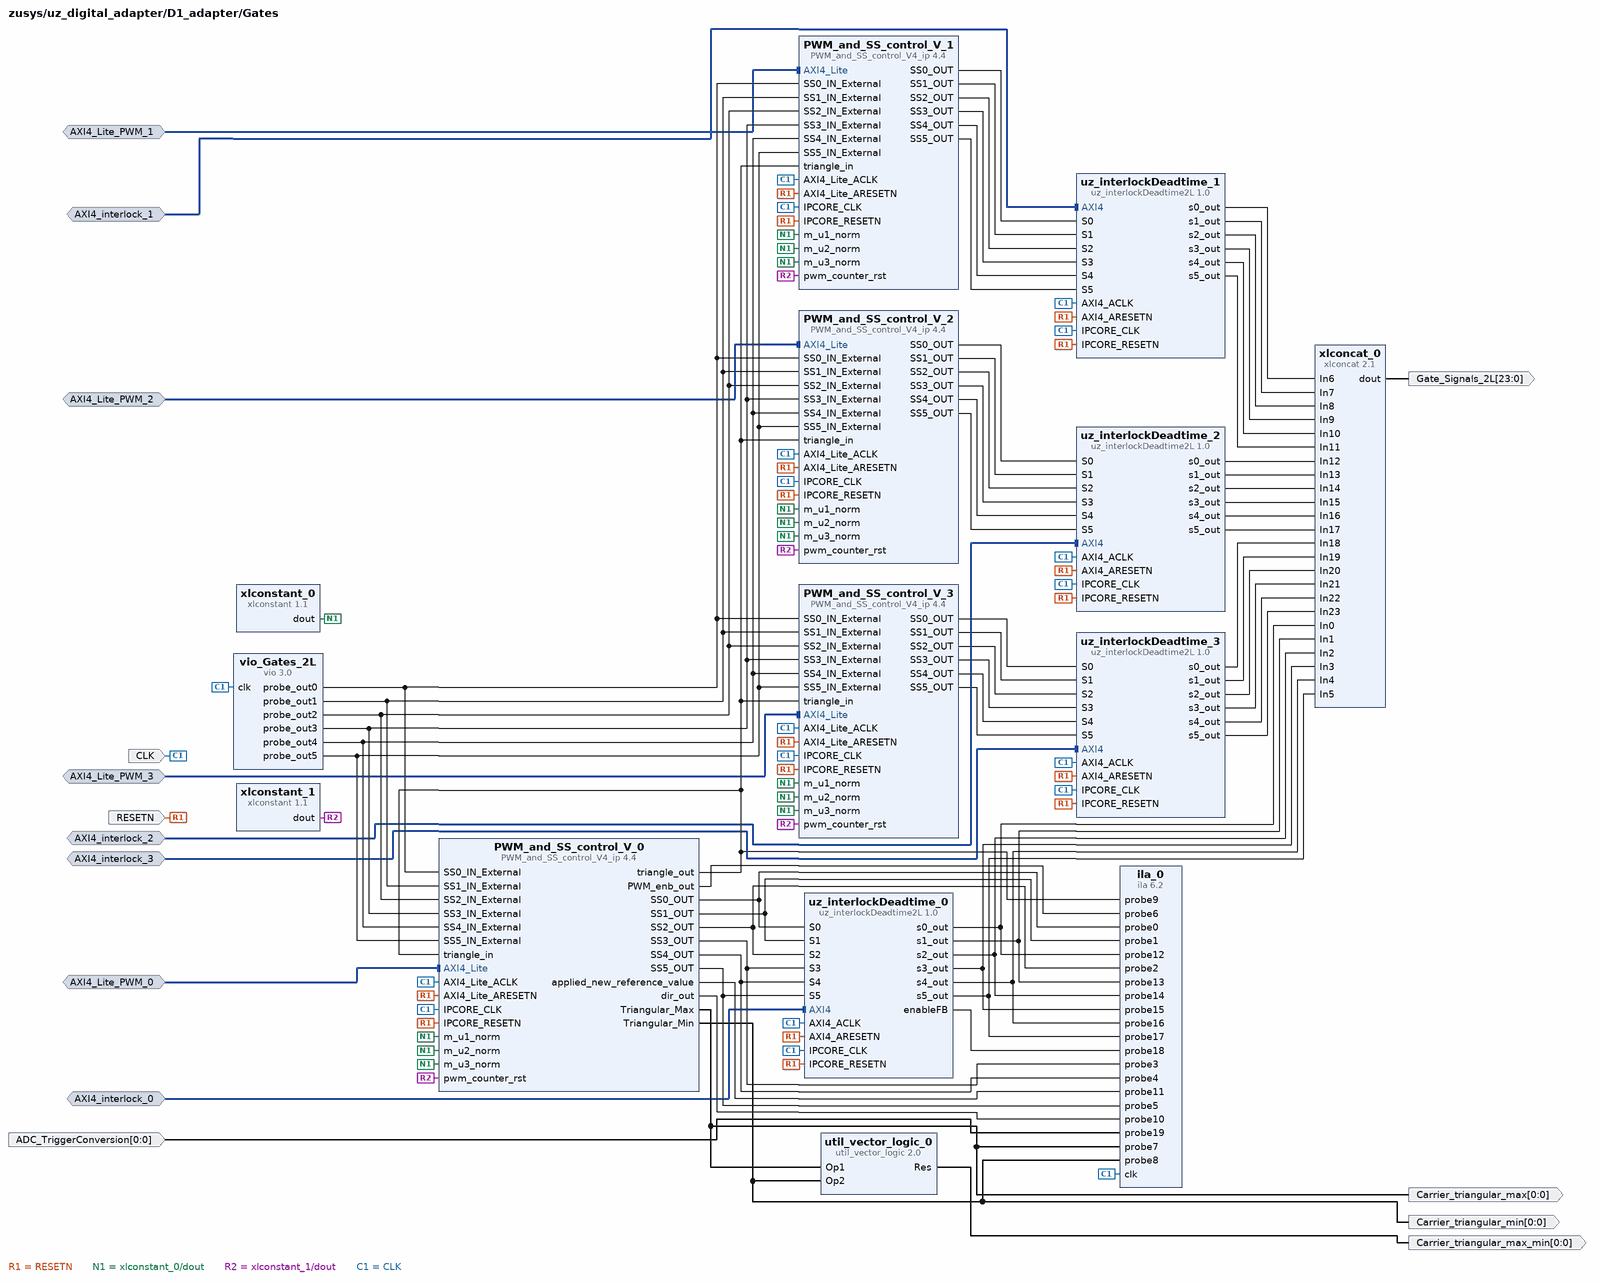
[diagram p8: block diagram inside /uz_digital_adapter/D1_adapter/Gates]
create_bd_intf_pin -mode Slave -vlnv xilinx.com:interface:aximm_rtl:1.0 AXI4_Lite_PWM_0
create_bd_intf_pin -mode Slave -vlnv xilinx.com:interface:aximm_rtl:1.0 AXI4_Lite_PWM_1
create_bd_intf_pin -mode Slave -vlnv xilinx.com:interface:aximm_rtl:1.0 AXI4_Lite_PWM_2
create_bd_intf_pin -mode Slave -vlnv xilinx.com:interface:aximm_rtl:1.0 AXI4_Lite_PWM_3
create_bd_intf_pin -mode Slave -vlnv xilinx.com:interface:aximm_rtl:1.0 AXI4_interlock_0
create_bd_intf_pin -mode Slave -vlnv xilinx.com:interface:aximm_rtl:1.0 AXI4_interlock_1
create_bd_intf_pin -mode Slave -vlnv xilinx.com:interface:aximm_rtl:1.0 AXI4_interlock_2
create_bd_intf_pin -mode Slave -vlnv xilinx.com:interface:aximm_rtl:1.0 AXI4_interlock_3
create_bd_pin -dir I -type clk CLK
create_bd_pin -dir O -from 0 -to 0 Carrier_triangular_max
create_bd_pin -dir O -from 0 -to 0 Carrier_triangular_max_min
create_bd_pin -dir O -from 0 -to 0 Carrier_triangular_min
create_bd_pin -dir O -from 23 -to 0 Gate_Signals_2L
create_bd_pin -dir I -type rst RESETN
create_bd_pin -dir I -from 0 -to 0 ADC_TriggerConversion

create_bd_cell -type ip -vlnv xilinx.com:ip:util_vector_logic:2.0 util_vector_logic_0
set_property -dict {CONFIG.C_OPERATION or CONFIG.C_SIZE 1} [get_bd_cells util_vector_logic_0]
create_bd_cell -type ip -vlnv user.org:ip:uz_interlockDeadtime2L:1.0 uz_interlockDeadtime_0
create_bd_cell -type ip -vlnv user.org:ip:uz_interlockDeadtime2L:1.0 uz_interlockDeadtime_1
create_bd_cell -type ip -vlnv user.org:ip:uz_interlockDeadtime2L:1.0 uz_interlockDeadtime_2
create_bd_cell -type ip -vlnv user.org:ip:uz_interlockDeadtime2L:1.0 uz_interlockDeadtime_3
create_bd_cell -type ip -vlnv xilinx.com:ip:vio:3.0 vio_Gates_2L
set_property -dict {CONFIG.C_NUM_PROBE_IN 0 CONFIG.C_NUM_PROBE_OUT 6} [get_bd_cells vio_Gates_2L]
create_bd_cell -type ip -vlnv xilinx.com:ip:xlconcat:2.1 xlconcat_0
set_property -dict {CONFIG.NUM_PORTS 24} [get_bd_cells xlconcat_0]
create_bd_cell -type ip -vlnv xilinx.com:ip:xlconstant:1.1 xlconstant_0
set_property -dict {CONFIG.CONST_VAL 0 CONFIG.CONST_WIDTH 18} [get_bd_cells xlconstant_0]
create_bd_cell -type ip -vlnv xilinx.com:ip:xlconstant:1.1 xlconstant_1
set_property -dict {CONFIG.CONST_VAL 0} [get_bd_cells xlconstant_1]
create_bd_cell -type ip -vlnv xilinx.com:ip:PWM_and_SS_control_V4_ip:4.4 PWM_and_SS_control_V_0
create_bd_cell -type ip -vlnv xilinx.com:ip:PWM_and_SS_control_V4_ip:4.4 PWM_and_SS_control_V_1
create_bd_cell -type ip -vlnv xilinx.com:ip:PWM_and_SS_control_V4_ip:4.4 PWM_and_SS_control_V_2
create_bd_cell -type ip -vlnv xilinx.com:ip:PWM_and_SS_control_V4_ip:4.4 PWM_and_SS_control_V_3
create_bd_cell -type ip -vlnv xilinx.com:ip:ila:6.2 ila_0
set_property -dict {CONFIG.C_DATA_DEPTH 16384 CONFIG.C_MONITOR_TYPE Native CONFIG.C_NUM_OF_PROBES 20} [get_bd_cells ila_0]

# ---- hierarchy /uz_digital_adapter/D2_adapter ----
current_bd_instance /uz_digital_adapter/D2_adapter
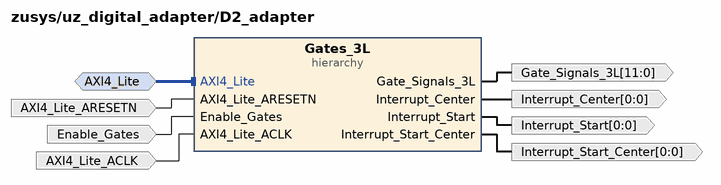
[diagram p9: block diagram inside /uz_digital_adapter/D2_adapter]
create_bd_intf_pin -mode Slave -vlnv xilinx.com:interface:aximm_rtl:1.0 AXI4_Lite
create_bd_pin -dir I -type clk AXI4_Lite_ACLK
create_bd_pin -dir I -type rst AXI4_Lite_ARESETN
create_bd_pin -dir I -type rst Enable_Gates
create_bd_pin -dir O -from 11 -to 0 Gate_Signals_3L
create_bd_pin -dir O -from 0 -to 0 Interrupt_Center
create_bd_pin -dir O -from 0 -to 0 Interrupt_Start
create_bd_pin -dir O -from 0 -to 0 Interrupt_Start_Center

create_bd_cell -type hier Gates_3L

# ---- hierarchy /uz_digital_adapter/D2_adapter/Gates_3L ----
current_bd_instance /uz_digital_adapter/D2_adapter/Gates_3L
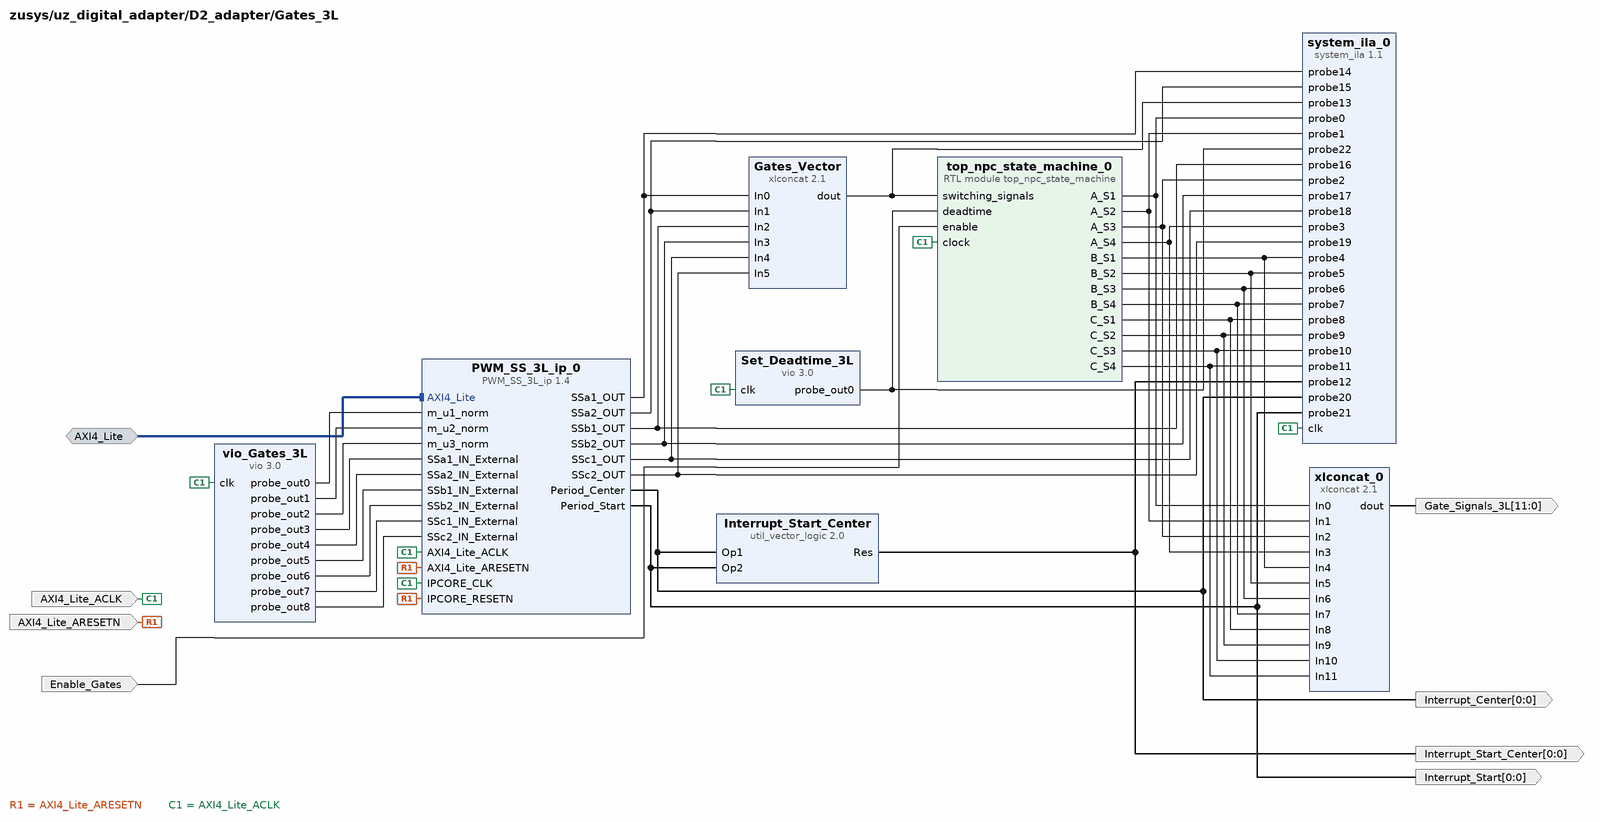
[diagram p10: block diagram inside /uz_digital_adapter/D2_adapter/Gates_3L]
create_bd_intf_pin -mode Slave -vlnv xilinx.com:interface:aximm_rtl:1.0 AXI4_Lite
create_bd_pin -dir I -type clk AXI4_Lite_ACLK
create_bd_pin -dir I -type rst AXI4_Lite_ARESETN
create_bd_pin -dir I -type rst Enable_Gates
create_bd_pin -dir O -from 11 -to 0 Gate_Signals_3L
create_bd_pin -dir O -from 0 -to 0 Interrupt_Center
create_bd_pin -dir O -from 0 -to 0 Interrupt_Start
create_bd_pin -dir O -from 0 -to 0 Interrupt_Start_Center

create_bd_cell -type ip -vlnv xilinx.com:ip:xlconcat:2.1 Gates_Vector
set_property -dict {CONFIG.NUM_PORTS 6} [get_bd_cells Gates_Vector]
create_bd_cell -type ip -vlnv xilinx.com:ip:util_vector_logic:2.0 Interrupt_Start_Center
set_property -dict {CONFIG.C_OPERATION or CONFIG.C_SIZE 1} [get_bd_cells Interrupt_Start_Center]
create_bd_cell -type ip -vlnv mwn.de:ip:PWM_SS_3L_ip:1.4 PWM_SS_3L_ip_0
create_bd_cell -type ip -vlnv xilinx.com:ip:vio:3.0 Set_Deadtime_3L
set_property -dict [list \
  CONFIG.C_NUM_PROBE_IN 0 \
  CONFIG.C_PROBE_OUT0_INIT_VAL 0x0C8 \
  CONFIG.C_PROBE_OUT0_WIDTH 10 \
] [get_bd_cells Set_Deadtime_3L]
create_bd_cell -type ip -vlnv xilinx.com:ip:system_ila:1.1 system_ila_0
set_property -dict {CONFIG.C_DATA_DEPTH 16384 CONFIG.C_MON_TYPE NATIVE CONFIG.C_NUM_OF_PROBES 23} [get_bd_cells system_ila_0]
create_bd_cell -type module -reference top_npc_state_machine top_npc_state_machine_0
create_bd_cell -type ip -vlnv xilinx.com:ip:vio:3.0 vio_Gates_3L
set_property -dict [list \
  CONFIG.C_NUM_PROBE_IN 0 \
  CONFIG.C_NUM_PROBE_OUT 9 \
  CONFIG.C_PROBE_OUT0_WIDTH 14 \
  CONFIG.C_PROBE_OUT1_WIDTH 14 \
  CONFIG.C_PROBE_OUT2_WIDTH 14 \
  CONFIG.C_PROBE_OUT6_WIDTH 1 \
  CONFIG.C_PROBE_OUT7_WIDTH 1 \
  CONFIG.C_PROBE_OUT8_WIDTH 1 \
] [get_bd_cells vio_Gates_3L]
create_bd_cell -type ip -vlnv xilinx.com:ip:xlconcat:2.1 xlconcat_0
set_property -dict {CONFIG.NUM_PORTS 12} [get_bd_cells xlconcat_0]

# ---- hierarchy /uz_digital_adapter/D3_adapter ----
current_bd_instance /uz_digital_adapter/D3_adapter
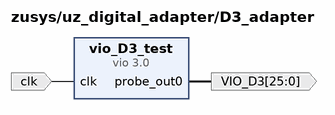
[diagram p11: block diagram inside /uz_digital_adapter/D3_adapter]
create_bd_pin -dir O -from 25 -to 0 VIO_D3
create_bd_pin -dir I -type clk clk

create_bd_cell -type ip -vlnv xilinx.com:ip:vio:3.0 vio_D3_test
set_property -dict {CONFIG.C_NUM_PROBE_IN 0 CONFIG.C_NUM_PROBE_OUT 1 CONFIG.C_PROBE_OUT0_WIDTH 26} [get_bd_cells vio_D3_test]

# ---- hierarchy /uz_digital_adapter/D5_adapter ----
current_bd_instance /uz_digital_adapter/D5_adapter
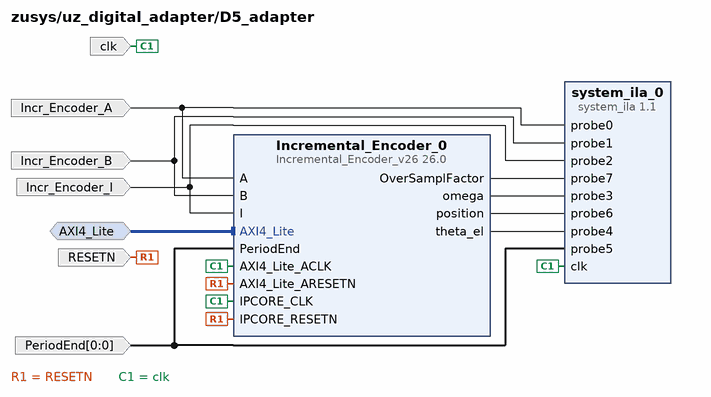
[diagram p12: block diagram inside /uz_digital_adapter/D5_adapter]
create_bd_intf_pin -mode Slave -vlnv xilinx.com:interface:aximm_rtl:1.0 AXI4_Lite
create_bd_pin -dir I Incr_Encoder_A
create_bd_pin -dir I Incr_Encoder_B
create_bd_pin -dir I Incr_Encoder_I
create_bd_pin -dir I -from 0 -to 0 PeriodEnd
create_bd_pin -dir I -type rst RESETN
create_bd_pin -dir I -type clk clk

create_bd_cell -type ip -vlnv xilinx.com:ip:Incremental_Encoder_v26:26.0 Incremental_Encoder_0
create_bd_cell -type ip -vlnv xilinx.com:ip:system_ila:1.1 system_ila_0
set_property -dict {CONFIG.C_DATA_DEPTH 16384 CONFIG.C_MON_TYPE NATIVE CONFIG.C_NUM_OF_PROBES 8} [get_bd_cells system_ila_0]

# ---- hierarchy /uz_system ----
current_bd_instance /uz_system
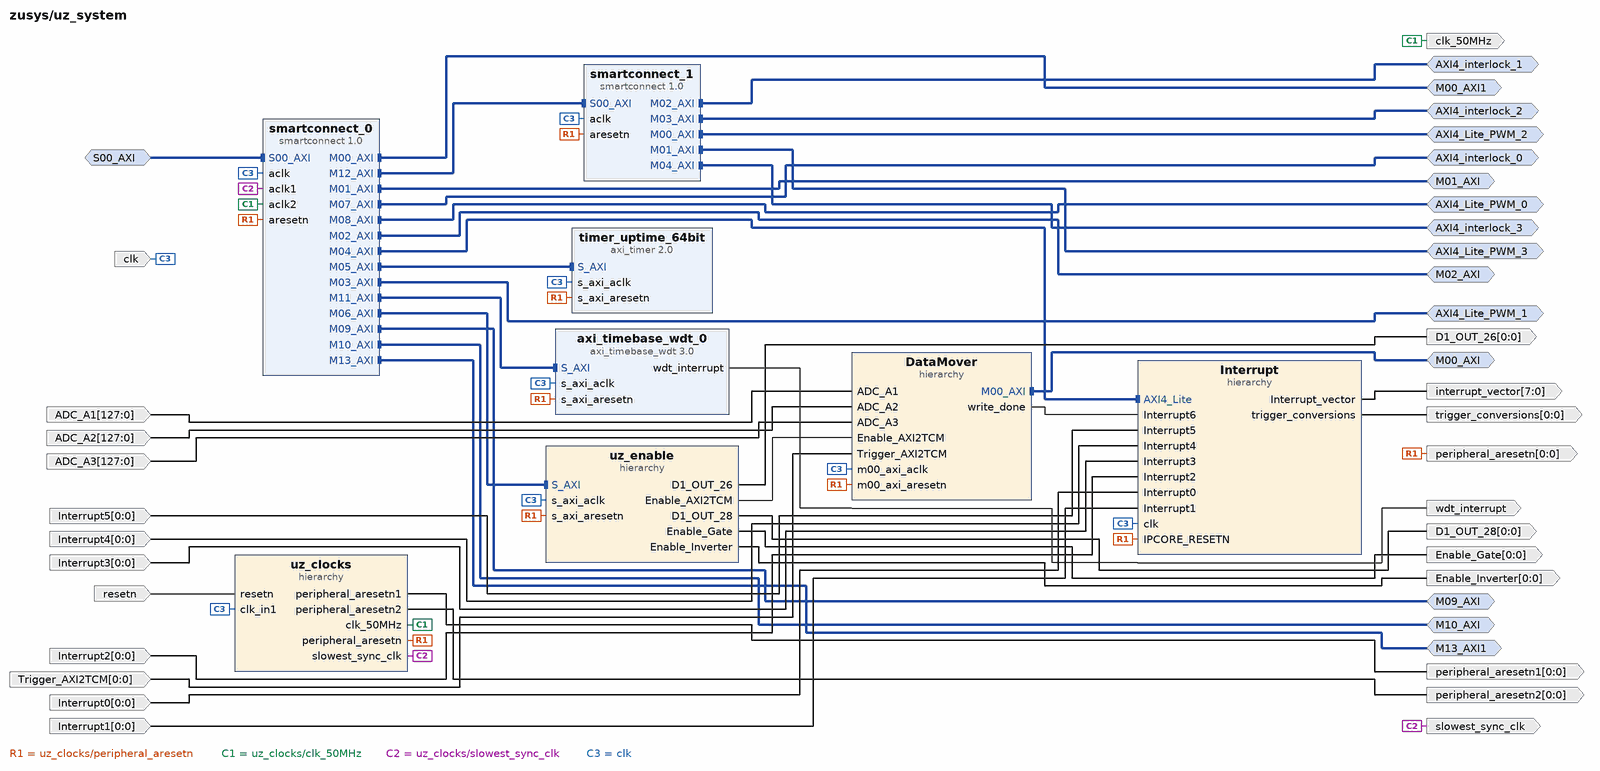
[diagram p13: block diagram inside /uz_system]
create_bd_intf_pin -mode Master -vlnv xilinx.com:interface:aximm_rtl:1.0 AXI4_Lite_PWM_0
create_bd_intf_pin -mode Master -vlnv xilinx.com:interface:aximm_rtl:1.0 AXI4_Lite_PWM_1
create_bd_intf_pin -mode Master -vlnv xilinx.com:interface:aximm_rtl:1.0 AXI4_Lite_PWM_2
create_bd_intf_pin -mode Master -vlnv xilinx.com:interface:aximm_rtl:1.0 AXI4_Lite_PWM_3
create_bd_intf_pin -mode Master -vlnv xilinx.com:interface:aximm_rtl:1.0 AXI4_interlock_0
create_bd_intf_pin -mode Master -vlnv xilinx.com:interface:aximm_rtl:1.0 AXI4_interlock_1
create_bd_intf_pin -mode Master -vlnv xilinx.com:interface:aximm_rtl:1.0 AXI4_interlock_2
create_bd_intf_pin -mode Master -vlnv xilinx.com:interface:aximm_rtl:1.0 AXI4_interlock_3
create_bd_intf_pin -mode Master -vlnv xilinx.com:interface:aximm_rtl:1.0 M00_AXI
create_bd_intf_pin -mode Master -vlnv xilinx.com:interface:aximm_rtl:1.0 M00_AXI1
create_bd_intf_pin -mode Master -vlnv xilinx.com:interface:aximm_rtl:1.0 M01_AXI
create_bd_intf_pin -mode Master -vlnv xilinx.com:interface:aximm_rtl:1.0 M02_AXI
create_bd_intf_pin -mode Master -vlnv xilinx.com:interface:aximm_rtl:1.0 M09_AXI
create_bd_intf_pin -mode Master -vlnv xilinx.com:interface:aximm_rtl:1.0 M10_AXI
create_bd_intf_pin -mode Master -vlnv xilinx.com:interface:aximm_rtl:1.0 M13_AXI1
create_bd_intf_pin -mode Slave -vlnv xilinx.com:interface:aximm_rtl:1.0 S00_AXI
create_bd_pin -dir I -from 127 -to 0 ADC_A1
create_bd_pin -dir I -from 127 -to 0 ADC_A2
create_bd_pin -dir I -from 127 -to 0 ADC_A3
create_bd_pin -dir O -from 0 -to 0 D1_OUT_26
create_bd_pin -dir O -from 0 -to 0 D1_OUT_28
create_bd_pin -dir O -from 0 -to 0 Enable_Gate
create_bd_pin -dir O -from 0 -to 0 Enable_Inverter
create_bd_pin -dir I -from 0 -to 0 Interrupt0
create_bd_pin -dir I -from 0 -to 0 Interrupt1
create_bd_pin -dir I -from 0 -to 0 Interrupt2
create_bd_pin -dir I -from 0 -to 0 Interrupt3
create_bd_pin -dir I -from 0 -to 0 Interrupt4
create_bd_pin -dir I -from 0 -to 0 Interrupt5
create_bd_pin -dir I -from 0 -to 0 Trigger_AXI2TCM
create_bd_pin -dir I -type clk clk
create_bd_pin -dir O -type clk clk_50MHz
create_bd_pin -dir O -from 7 -to 0 interrupt_vector
create_bd_pin -dir O -from 0 -to 0 -type rst peripheral_aresetn
create_bd_pin -dir O -from 0 -to 0 -type rst peripheral_aresetn1
create_bd_pin -dir O -from 0 -to 0 -type rst peripheral_aresetn2
create_bd_pin -dir I -type rst resetn
create_bd_pin -dir O -type clk slowest_sync_clk
create_bd_pin -dir O -from 0 -to 0 trigger_conversions
create_bd_pin -dir O -type intr wdt_interrupt

create_bd_cell -type hier DataMover
create_bd_cell -type hier Interrupt
create_bd_cell -type ip -vlnv xilinx.com:ip:axi_timebase_wdt:3.0 axi_timebase_wdt_0
set_property -dict {CONFIG.ENABLE_WINDOW_WDT 1 CONFIG.SST_COUNT_WIDTH 30} [get_bd_cells axi_timebase_wdt_0]
create_bd_cell -type ip -vlnv xilinx.com:ip:smartconnect:1.0 smartconnect_0
set_property -dict {CONFIG.NUM_CLKS 3 CONFIG.NUM_MI 14 CONFIG.NUM_SI 1} [get_bd_cells smartconnect_0]
create_bd_cell -type ip -vlnv xilinx.com:ip:smartconnect:1.0 smartconnect_1
set_property -dict {CONFIG.NUM_MI 5 CONFIG.NUM_SI 1} [get_bd_cells smartconnect_1]
create_bd_cell -type ip -vlnv xilinx.com:ip:axi_timer:2.0 timer_uptime_64bit
set_property -dict {CONFIG.mode_64bit 1} [get_bd_cells timer_uptime_64bit]
create_bd_cell -type hier uz_clocks
create_bd_cell -type hier uz_enable

# ---- hierarchy /uz_system/DataMover ----
current_bd_instance /uz_system/DataMover
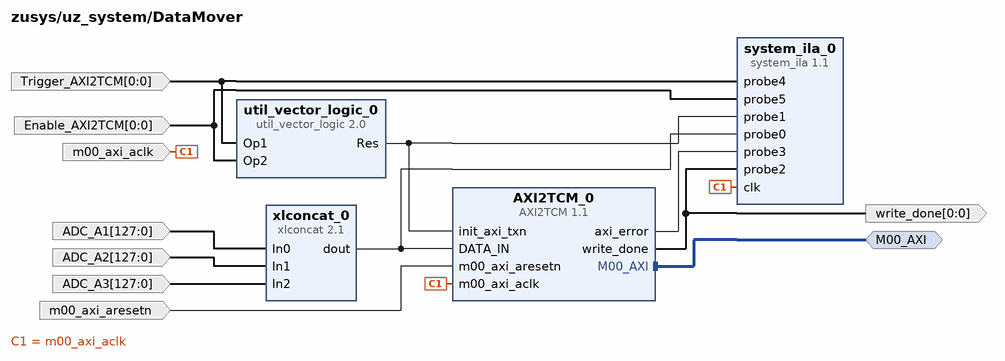
[diagram p14: block diagram inside /uz_system/DataMover]
create_bd_intf_pin -mode Master -vlnv xilinx.com:interface:aximm_rtl:1.0 M00_AXI
create_bd_pin -dir I -from 127 -to 0 ADC_A1
create_bd_pin -dir I -from 127 -to 0 ADC_A2
create_bd_pin -dir I -from 127 -to 0 ADC_A3
create_bd_pin -dir I -from 0 -to 0 Enable_AXI2TCM
create_bd_pin -dir I -from 0 -to 0 Trigger_AXI2TCM
create_bd_pin -dir I -type clk m00_axi_aclk
create_bd_pin -dir I -type rst m00_axi_aresetn
create_bd_pin -dir O -from 0 -to 0 write_done

create_bd_cell -type ip -vlnv TUM:user:AXI2TCM:1.1 AXI2TCM_0
set_property -dict {CONFIG.C_M00_NUMBER_of_ADCs 24} [get_bd_cells AXI2TCM_0]
create_bd_cell -type ip -vlnv xilinx.com:ip:system_ila:1.1 system_ila_0
set_property -dict {CONFIG.C_DATA_DEPTH 1024 CONFIG.C_MON_TYPE NATIVE CONFIG.C_NUM_OF_PROBES 6} [get_bd_cells system_ila_0]
create_bd_cell -type ip -vlnv xilinx.com:ip:util_vector_logic:2.0 util_vector_logic_0
set_property -dict {CONFIG.C_SIZE 1} [get_bd_cells util_vector_logic_0]
create_bd_cell -type ip -vlnv xilinx.com:ip:xlconcat:2.1 xlconcat_0
set_property -dict {CONFIG.NUM_PORTS 3} [get_bd_cells xlconcat_0]

# ---- hierarchy /uz_system/Interrupt ----
current_bd_instance /uz_system/Interrupt
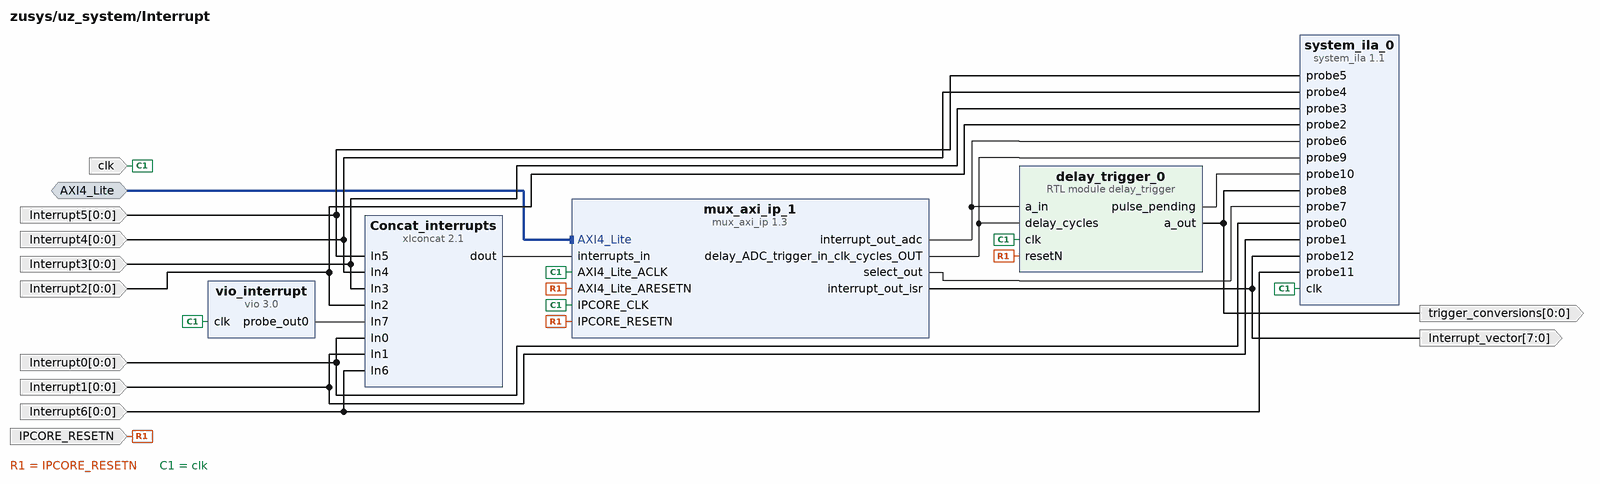
[diagram p15: block diagram inside /uz_system/Interrupt]
create_bd_intf_pin -mode Slave -vlnv xilinx.com:interface:aximm_rtl:1.0 AXI4_Lite
create_bd_pin -dir I -type rst IPCORE_RESETN
create_bd_pin -dir I -from 0 -to 0 Interrupt0
create_bd_pin -dir I -from 0 -to 0 Interrupt1
create_bd_pin -dir I -from 0 -to 0 Interrupt2
create_bd_pin -dir I -from 0 -to 0 Interrupt3
create_bd_pin -dir I -from 0 -to 0 Interrupt4
create_bd_pin -dir I -from 0 -to 0 Interrupt5
create_bd_pin -dir I -from 0 -to 0 Interrupt6
create_bd_pin -dir O -from 7 -to 0 Interrupt_vector
create_bd_pin -dir I -type clk clk
create_bd_pin -dir O -from 0 -to 0 -type intr trigger_conversions

create_bd_cell -type ip -vlnv xilinx.com:ip:xlconcat:2.1 Concat_interrupts
set_property -dict {CONFIG.NUM_PORTS 8} [get_bd_cells Concat_interrupts]
create_bd_cell -type ip -vlnv xilinx.com:ip:system_ila:1.1 system_ila_0
set_property -dict {CONFIG.C_DATA_DEPTH 16384 CONFIG.C_MON_TYPE NATIVE CONFIG.C_NUM_OF_PROBES 13} [get_bd_cells system_ila_0]
create_bd_cell -type ip -vlnv xilinx.com:ip:vio:3.0 vio_interrupt
set_property -dict {CONFIG.C_NUM_PROBE_IN 0} [get_bd_cells vio_interrupt]
create_bd_cell -type module -reference delay_trigger delay_trigger_0
create_bd_cell -type ip -vlnv mwn.de:ip:mux_axi_ip:1.3 mux_axi_ip_1

# ---- hierarchy /uz_system/uz_clocks ----
current_bd_instance /uz_system/uz_clocks
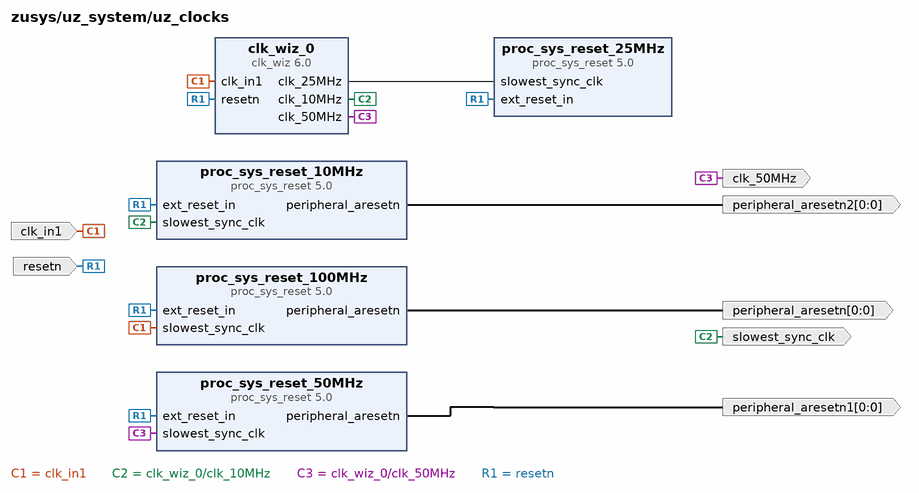
[diagram p16: block diagram inside /uz_system/uz_clocks]
create_bd_pin -dir O -type clk clk_50MHz
create_bd_pin -dir I -type clk clk_in1
create_bd_pin -dir O -from 0 -to 0 -type rst peripheral_aresetn
create_bd_pin -dir O -from 0 -to 0 -type rst peripheral_aresetn1
create_bd_pin -dir O -from 0 -to 0 -type rst peripheral_aresetn2
create_bd_pin -dir I -type rst resetn
create_bd_pin -dir O -type clk slowest_sync_clk

create_bd_cell -type ip -vlnv xilinx.com:ip:clk_wiz:6.0 clk_wiz_0
set_property -dict [list \
  CONFIG.AUTO_PRIMITIVE PLL \
  CONFIG.CLKOUT1_DRIVES Buffer \
  CONFIG.CLKOUT1_JITTER 167.017 \
  CONFIG.CLKOUT1_PHASE_ERROR 114.212 \
  CONFIG.CLKOUT1_REQUESTED_OUT_FREQ 50.000 \
  CONFIG.CLKOUT2_DRIVES Buffer \
  CONFIG.CLKOUT2_JITTER 229.362 \
  CONFIG.CLKOUT2_PHASE_ERROR 114.212 \
  CONFIG.CLKOUT2_REQUESTED_OUT_FREQ 10.000 \
  CONFIG.CLKOUT2_USED true \
  CONFIG.CLKOUT3_DRIVES Buffer \
  CONFIG.CLKOUT3_JITTER 191.696 \
  CONFIG.CLKOUT3_PHASE_ERROR 114.212 \
  CONFIG.CLKOUT3_REQUESTED_OUT_FREQ 25.000 \
  CONFIG.CLKOUT3_USED true \
  CONFIG.CLKOUT4_DRIVES Buffer \
  CONFIG.CLKOUT5_DRIVES Buffer \
  CONFIG.CLKOUT6_DRIVES Buffer \
  CONFIG.CLKOUT7_DRIVES Buffer \
  CONFIG.CLK_OUT1_PORT clk_50MHz \
  CONFIG.CLK_OUT2_PORT clk_10MHz \
  CONFIG.CLK_OUT3_PORT clk_25MHz \
  CONFIG.FEEDBACK_SOURCE FDBK_AUTO \
  CONFIG.MMCM_CLKFBOUT_MULT_F 8 \
  CONFIG.MMCM_CLKIN1_PERIOD 10.000 \
  CONFIG.MMCM_CLKIN2_PERIOD 10.000 \
  CONFIG.MMCM_CLKOUT0_DIVIDE_F 16 \
  CONFIG.MMCM_CLKOUT1_DIVIDE 80 \
  CONFIG.MMCM_CLKOUT2_DIVIDE 32 \
  CONFIG.MMCM_COMPENSATION AUTO \
  CONFIG.MMCM_DIVCLK_DIVIDE 1 \
  CONFIG.NUM_OUT_CLKS 3 \
  CONFIG.OVERRIDE_MMCM false \
  CONFIG.PRIMITIVE Auto \
  CONFIG.PRIM_SOURCE Single_ended_clock_capable_pin \
  CONFIG.RESET_PORT resetn \
  CONFIG.RESET_TYPE ACTIVE_LOW \
  CONFIG.SECONDARY_SOURCE Single_ended_clock_capable_pin \
  CONFIG.USE_LOCKED false \
  CONFIG.USE_PHASE_ALIGNMENT false \
  CONFIG.USE_RESET true \
] [get_bd_cells clk_wiz_0]
create_bd_cell -type ip -vlnv xilinx.com:ip:proc_sys_reset:5.0 proc_sys_reset_100MHz
create_bd_cell -type ip -vlnv xilinx.com:ip:proc_sys_reset:5.0 proc_sys_reset_10MHz
create_bd_cell -type ip -vlnv xilinx.com:ip:proc_sys_reset:5.0 proc_sys_reset_25MHz
create_bd_cell -type ip -vlnv xilinx.com:ip:proc_sys_reset:5.0 proc_sys_reset_50MHz

# ---- hierarchy /uz_system/uz_enable ----
current_bd_instance /uz_system/uz_enable
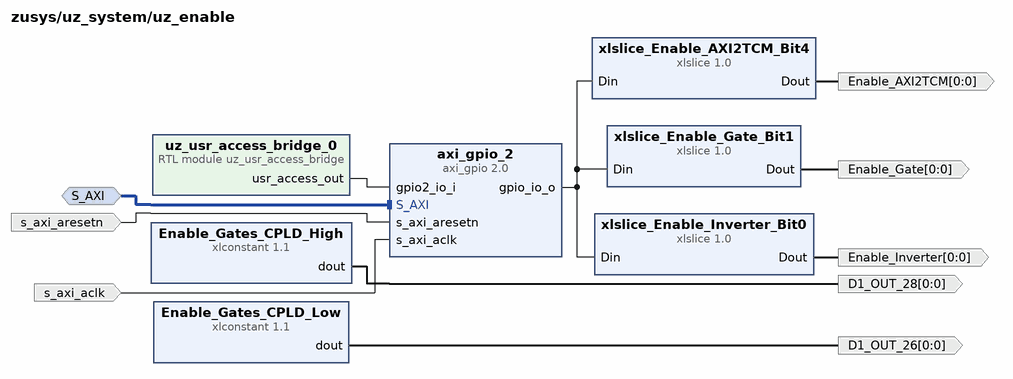
[diagram p17: block diagram inside /uz_system/uz_enable]
create_bd_intf_pin -mode Slave -vlnv xilinx.com:interface:aximm_rtl:1.0 S_AXI
create_bd_pin -dir O -from 0 -to 0 D1_OUT_26
create_bd_pin -dir O -from 0 -to 0 D1_OUT_28
create_bd_pin -dir O -from 0 -to 0 Enable_AXI2TCM
create_bd_pin -dir O -from 0 -to 0 Enable_Gate
create_bd_pin -dir O -from 0 -to 0 Enable_Inverter
create_bd_pin -dir I -type clk s_axi_aclk
create_bd_pin -dir I -type rst s_axi_aresetn

create_bd_cell -type ip -vlnv xilinx.com:ip:xlconstant:1.1 Enable_Gates_CPLD_High
create_bd_cell -type ip -vlnv xilinx.com:ip:xlconstant:1.1 Enable_Gates_CPLD_Low
set_property -dict {CONFIG.CONST_VAL 0} [get_bd_cells Enable_Gates_CPLD_Low]
create_bd_cell -type ip -vlnv xilinx.com:ip:axi_gpio:2.0 axi_gpio_2
set_property -dict [list \
  CONFIG.C_ALL_INPUTS_2 1 \
  CONFIG.C_ALL_OUTPUTS 0 \
  CONFIG.C_GPIO_WIDTH 8 \
  CONFIG.C_IS_DUAL 1 \
] [get_bd_cells axi_gpio_2]
create_bd_cell -type module -reference uz_usr_access_bridge uz_usr_access_bridge_0
create_bd_cell -type ip -vlnv xilinx.com:ip:xlslice:1.0 xlslice_Enable_AXI2TCM_Bit4
set_property -dict [list \
  CONFIG.DIN_FROM 4 \
  CONFIG.DIN_TO 4 \
  CONFIG.DIN_WIDTH 8 \
  CONFIG.DOUT_WIDTH 1 \
] [get_bd_cells xlslice_Enable_AXI2TCM_Bit4]
create_bd_cell -type ip -vlnv xilinx.com:ip:xlslice:1.0 xlslice_Enable_Gate_Bit1
set_property -dict [list \
  CONFIG.DIN_FROM 1 \
  CONFIG.DIN_TO 1 \
  CONFIG.DIN_WIDTH 8 \
  CONFIG.DOUT_WIDTH 1 \
] [get_bd_cells xlslice_Enable_Gate_Bit1]
create_bd_cell -type ip -vlnv xilinx.com:ip:xlslice:1.0 xlslice_Enable_Inverter_Bit0
set_property -dict {CONFIG.DIN_FROM 0 CONFIG.DIN_TO 0 CONFIG.DIN_WIDTH 8} [get_bd_cells xlslice_Enable_Inverter_Bit0]

# ---- hierarchy /uz_user ----
current_bd_instance /uz_user
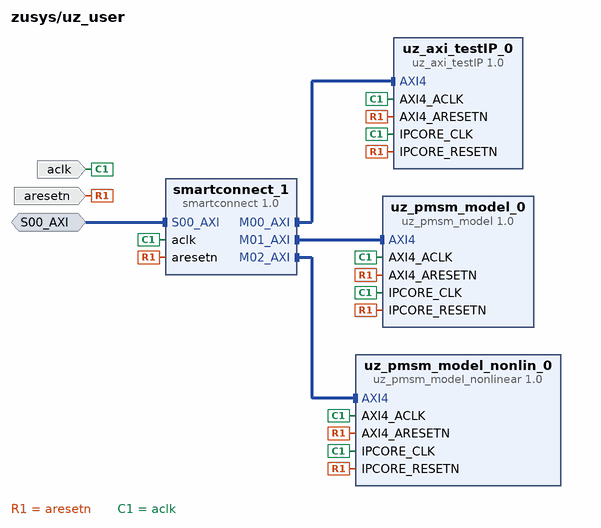
[diagram p18: block diagram inside /uz_user]
create_bd_intf_pin -mode Slave -vlnv xilinx.com:interface:aximm_rtl:1.0 S00_AXI
create_bd_pin -dir I -type clk aclk
create_bd_pin -dir I -type rst aresetn

create_bd_cell -type ip -vlnv xilinx.com:ip:smartconnect:1.0 smartconnect_1
set_property -dict {CONFIG.NUM_MI 3 CONFIG.NUM_SI 1} [get_bd_cells smartconnect_1]
create_bd_cell -type ip -vlnv user.org:ip:uz_axi_testIP:1.0 uz_axi_testIP_0
create_bd_cell -type ip -vlnv user.org:ip:uz_pmsm_model:1.0 uz_pmsm_model_0
create_bd_cell -type ip -vlnv xilinx.com:ip:uz_pmsm_model_nonlinear:1.0 uz_pmsm_model_nonlin_0

# ---- connections ----

current_bd_instance /uz_analog_adapter
connect_bd_intf_net [get_bd_intf_pins S00_AXI1] [get_bd_intf_pins A1_adapter/S00_AXI]
connect_bd_intf_net [get_bd_intf_pins S00_AXI] [get_bd_intf_pins A3_adapter/S00_AXI]
connect_bd_intf_net [get_bd_intf_pins S00_AXI2] [get_bd_intf_pins A2_adapter/S00_AXI]
connect_bd_net [get_bd_pins A1_IN] [get_bd_pins A1_adapter/A1_IN]
connect_bd_net -net A1_adapter_Din [get_bd_pins A1_adapter/A1_RAW_Value] [get_bd_pins A1_RAW_Value]
connect_bd_net -net A1_adapter_probe4 [get_bd_pins A1_adapter/A1_RAW_Valid] [get_bd_pins A1_RAW_Valid]
connect_bd_net [get_bd_pins A2_IN] [get_bd_pins A2_adapter/A2_IN]
connect_bd_net [get_bd_pins A2_adapter/RAW_VALUE] [get_bd_pins A2_RAW_Value]
connect_bd_net [get_bd_pins A3_IN] [get_bd_pins A3_adapter/A3_IN]
connect_bd_net [get_bd_pins A3_adapter/RAW_VALUE] [get_bd_pins A3_RAW_Value]
connect_bd_net -net ADC_LTC2311_0_SS_N [get_bd_pins A2_adapter/A2_OUT_CNV_1] [get_bd_pins A2_OUT_CNV_1]
connect_bd_net -net ADC_LTC2311_1_SS_N [get_bd_pins A1_adapter/A1_OUT_CNV_1] [get_bd_pins A1_OUT_CNV_1]
connect_bd_net -net ADC_LTC2311_2_SS_N [get_bd_pins A3_adapter/A3_OUT_CNV_1] [get_bd_pins A3_OUT_CNV_1]
connect_bd_net -net Interrupt_muxed [get_bd_pins TRIGGER_CNV] \
  [get_bd_pins A1_adapter/TRIGGER_CNV] [get_bd_pins A2_adapter/TRIGGER_CNV] [get_bd_pins A3_adapter/TRIGGER_CNV]
connect_bd_net -net iobufds_inst_0_SCLK_OUT [get_bd_pins A1_adapter/A1_OUT_CLK] [get_bd_pins A1_OUT_CLK]
connect_bd_net -net iobufds_inst_1_SCLK_OUT [get_bd_pins A2_adapter/A2_OUT_CLK] [get_bd_pins A2_OUT_CLK]
connect_bd_net -net iobufds_inst_2_SCLK_OUT [get_bd_pins A3_adapter/A3_OUT_CLK] [get_bd_pins A3_OUT_CLK]
connect_bd_net -net proc_sys_reset_1_peripheral_aresetn [get_bd_pins s00_axi_aresetn] \
  [get_bd_pins A1_adapter/s00_axi_aresetn] [get_bd_pins A2_adapter/s00_axi_aresetn] [get_bd_pins A3_adapter/s00_axi_aresetn]
connect_bd_net -net zynq_ultra_ps_e_0_pl_clk1 [get_bd_pins s00_axi_aclk] \
  [get_bd_pins A1_adapter/clk] [get_bd_pins A2_adapter/s00_axi_aclk] [get_bd_pins A3_adapter/s00_axi_aclk]

current_bd_instance /uz_analog_adapter/A1_adapter
connect_bd_intf_net [get_bd_intf_pins S00_AXI] [get_bd_intf_pins A1_ADC_LTC2311/S00_AXI]
connect_bd_net [get_bd_pins A1_ADC_LTC2311/SAMPLE_COUNTER] [get_bd_pins adc_debug/probe6]
connect_bd_net [get_bd_pins A1_ADC_LTC2311/SCLK] [get_bd_pins A1_iobufds_inst/SCLK_IN]
connect_bd_net [get_bd_pins A1_ADC_LTC2311/SI_VALID] [get_bd_pins adc_debug/probe7]
connect_bd_net [get_bd_pins A1_ADC_LTC2311/SI_VALUE] [get_bd_pins adc_debug/Din1]
connect_bd_net [get_bd_pins A1_IN] [get_bd_pins A1_iobufds_inst/MISO_IN]
connect_bd_net -net ADC_LTC2311_1_RAW_VALUE [get_bd_pins A1_ADC_LTC2311/RAW_VALUE] [get_bd_pins A1_RAW_Value] [get_bd_pins adc_debug/Din]
connect_bd_net -net ADC_LTC2311_1_SS_N [get_bd_pins A1_ADC_LTC2311/SS_N] [get_bd_pins A1_OUT_CNV_1]
connect_bd_net -net Interrupt_muxed [get_bd_pins TRIGGER_CNV] [get_bd_pins A1_ADC_LTC2311/TRIGGER_CNV] [get_bd_pins adc_debug/probe5]
connect_bd_net -net Valid_A1 [get_bd_pins A1_ADC_LTC2311/RAW_VALID] [get_bd_pins A1_RAW_Valid] [get_bd_pins adc_debug/probe4]
connect_bd_net -net iobufds_inst_0_MISO_OUT [get_bd_pins A1_iobufds_inst/MISO_OUT] [get_bd_pins A1_ADC_LTC2311/MISO]
connect_bd_net -net iobufds_inst_0_SCLK_OUT [get_bd_pins A1_iobufds_inst/SCLK_OUT] [get_bd_pins A1_OUT_CLK]
connect_bd_net -net proc_sys_reset_1_peripheral_aresetn [get_bd_pins s00_axi_aresetn] [get_bd_pins A1_ADC_LTC2311/s00_axi_aresetn]
connect_bd_net -net xlconstant_0_dout [get_bd_pins A1_inv_input/dout] [get_bd_pins A1_iobufds_inst/INVERT_OUTPUT]
connect_bd_net -net zynq_ultra_ps_e_0_pl_clk1 [get_bd_pins clk] [get_bd_pins A1_ADC_LTC2311/s00_axi_aclk] [get_bd_pins adc_debug/clk]
